# EAGLE design Reactor Core (EAGLE 6.2)

## Sheet 1 of 4
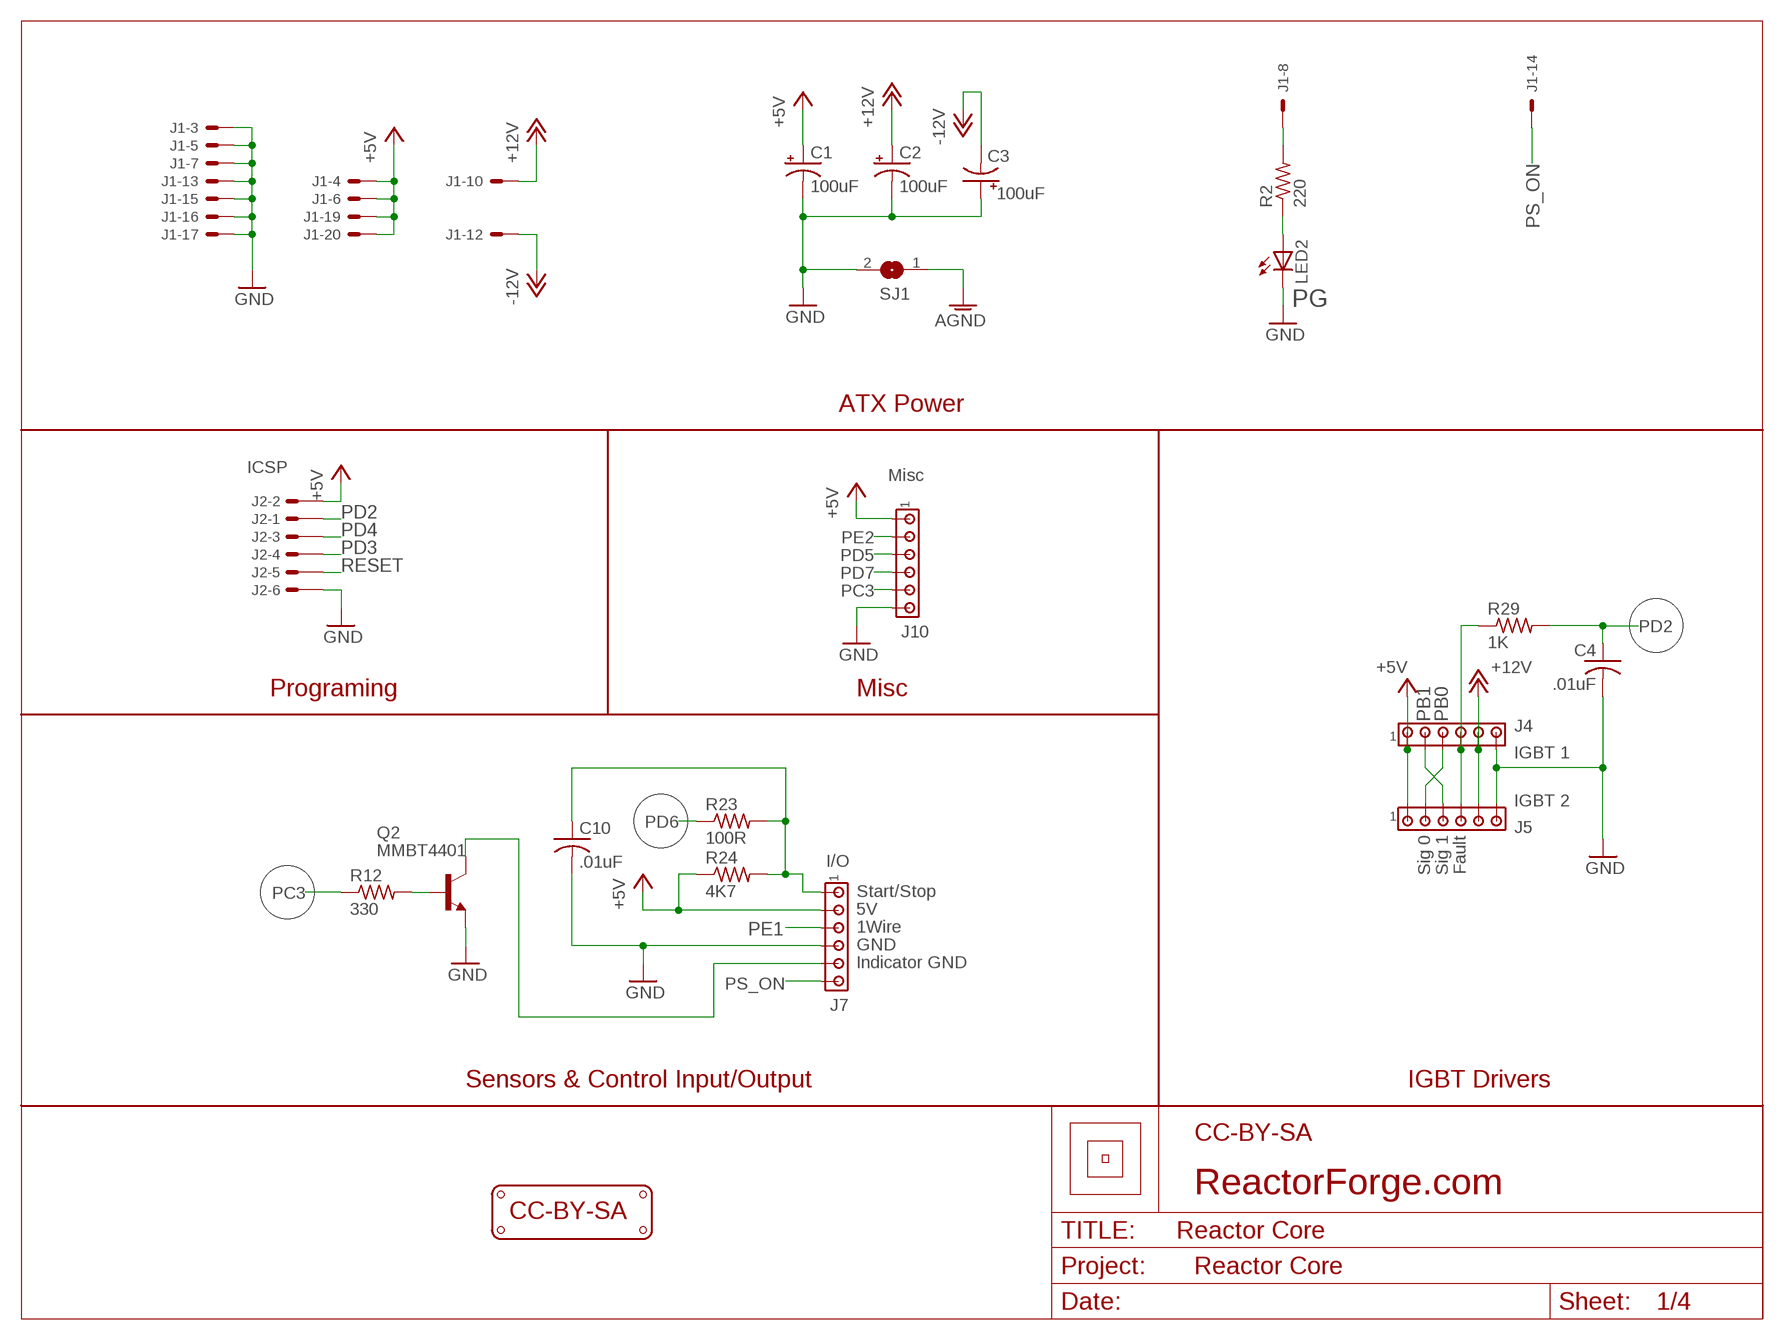
[diagram p0: schematic, sheet 1]
U$1 (LETTER_L): LICENSE: CC-BY-SA; PROJECT: Reactor Core; URL: ReactorForge.com

### Parts
C1  100uF  CPOL-USE2-5  [E2-5]
C2  100uF  CPOL-USE2-5  [E2-5]
C3  100uF  CPOL-USE2-5  [E2-5]
C4  .01uF  C-USC1206  [C1206]
C10  .01uF  C-USC1206K  [C1206K]
J1  ATX Power  5566-20  [5566-20]
J2  ICSP  057-006-1  [057-006-1]
J4  IGBT 1  MTA06-100  [10X06MTA]
J5  IGBT 2  MTA06-100  [10X06MTA]
J7  I/O  MTA06-100  [10X06MTA]
J10  Misc  MTA06-100  [10X06MTA]
LED2  LEDCHIPLED_1206  [CHIPLED_1206]
LOGO1  LOGO_CC-BY-SA  [LOGO_CC-BY-SA]
Q2  MMBT4401  [SOT23]
R2  220  R-US_R1206  [R1206]
R12  330  R-US_R1206  [R1206]
R23  100R  R-US_R1206  [R1206]
R24  4K7  R-US_R1206  [R1206]
R29  1K  R-US_R1206  [R1206]
SJ1  0  SJ  [SJ]

### Nets
+5V [power]: C1.+ J1.4 J1.6 J1.19 J1.20 J2.2 J4.6 J5.6 J7.5 J10.6 R24.1 ; also sheet 2,3
+12V [power]: C2.+ J1.10 J4.2 J5.2 ; also sheet 3
-12V [power]: C3.- J1.12 ; also sheet 3
AGND [power]: SJ1.1 ; also sheet 2
FAULT: J4.3 J5.3 R29.1
GND [power]: C1.- C2.- C3.+ C4.2 C10.2 J1.3 J1.5 J1.7 J1.13 J1.15 J1.16 J1.17 J2.6 J4.1 J5.1 J7.3 J10.1 LED2.C Q2.2(E) SJ1.2 ; also sheet 2,3
N$5: LED2.A R2.1
N$10: J7.2 Q2.3(C)
N$14: Q2.1(B) R12.2
N$17 [power]: C10.1 J7.6 R23.2 R24.2
PB0: J4.4 J5.5 ; also sheet 2
PB1: J4.5 J5.4 ; also sheet 2
PC3: J10.2 R12.1 ; also sheet 2
PD2: C4.1 J2.1 R29.2 ; also sheet 2
PD3: J2.4 ; also sheet 2
PD4: J2.3 ; also sheet 2
PD5: J10.4 ; also sheet 2,3
PD6: R23.1 ; also sheet 2
PD7: J10.3 ; also sheet 2,3
PE1: J7.4 ; also sheet 2
PE2: J10.5 ; also sheet 2
PG: J1.8 R2.2
PS_ON: J1.14 J7.1
RESET: J2.5 ; also sheet 2
Unconnected: J1.1 J1.2 J1.9 J1.11 J1.18

### Notes on the sheet
- ATX Power
- Programing | Misc
- Sig 0 | Sig 1 | Fault
- Start/Stop
- 5V
- 1Wire
- GND
- Indicator GND
- Sensors & Control Input/Output | IGBT Drivers

## Sheet 2 of 4
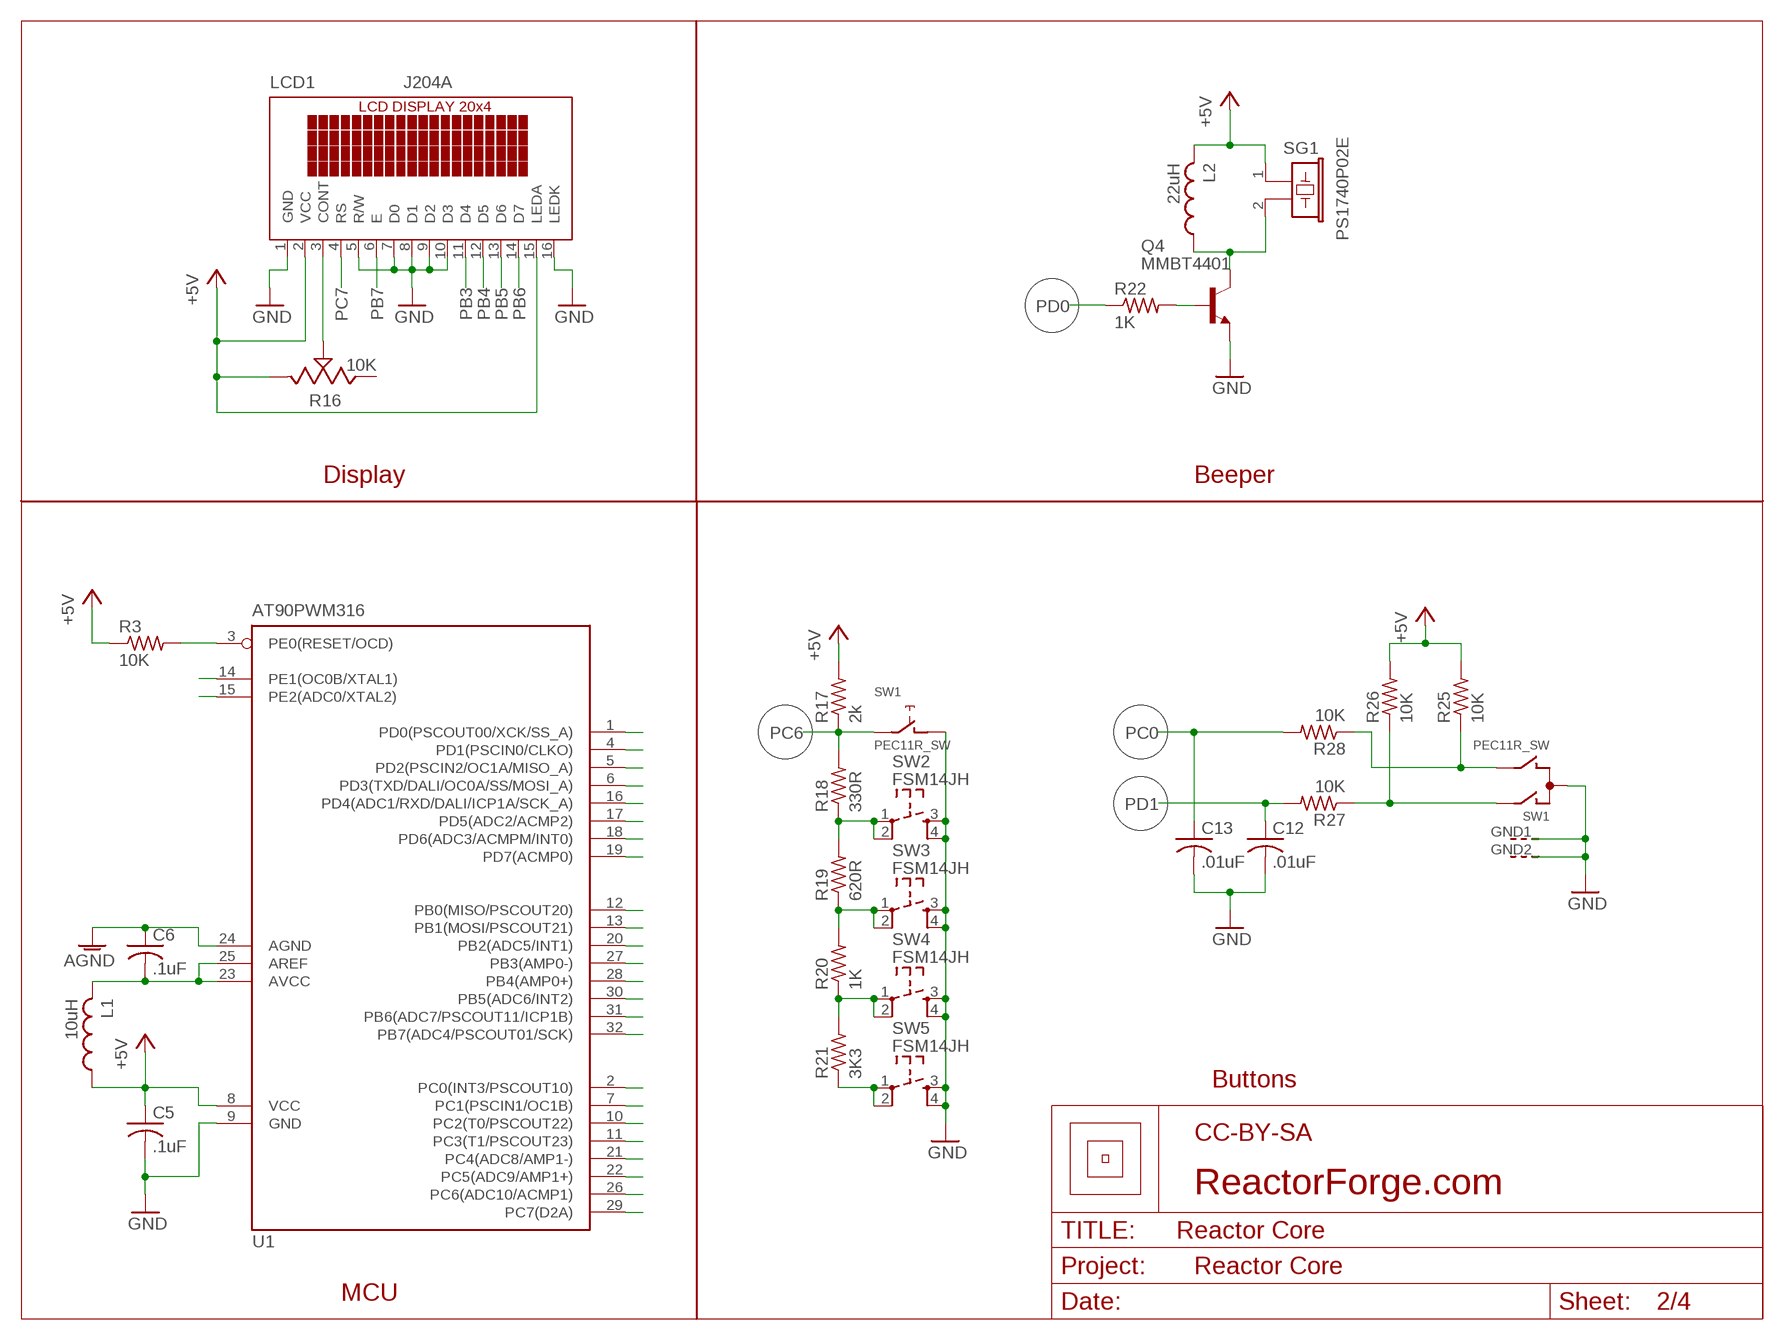
[diagram p1: schematic, sheet 2]
U$3 (LETTER_L): LICENSE: CC-BY-SA; PROJECT: Reactor Core; URL: ReactorForge.com

### Parts
C5  .1uF  C-USC1206K  [C1206K]
C6  .1uF  C-USC1206K  [C1206K]
C12  .01uF  C-USC1206K  [C1206K]
C13  .01uF  C-USC1206K  [C1206K]
L1  10uH  L-USL3225P  [L3225P]
L2  22uH  L-USL3225P  [L3225P]
LCD1  J204A  [LCD-20X4]
Q4  MMBT4401  [SOT23]
R3  10K  R-US_R1206  [R1206]
R16  10K  TRIMMER_3314G  [TRIMMER_3314G]
R17  2k  R-US_R1206  [R1206]
R18  330R  R-US_R1206  [R1206]
R19  620R  R-US_R1206  [R1206]
R20  1K  R-US_R1206  [R1206]
R21  3K3  R-US_R1206  [R1206]
R22  1K  R-US_R1206  [R1206]
R25  10K  R-US_M1206  [M1206]
R26  10K  R-US_M1206  [M1206]
R27  10K  R-US_R1206  [R1206]
R28  10K  R-US_R1206  [R1206]
SG1  PS1740P02E  F/EE17P  [F/EE17P]
SW1  PEC11R_SW  [BOURNS_PEC11R_SW]
SW2  FSM14JH  SW_TACTILE_TOP_ACTIVATED  [SW_TACTILE_TOP_ACTIVATED]
SW3  FSM14JH  SW_TACTILE_TOP_ACTIVATED  [SW_TACTILE_TOP_ACTIVATED]
SW4  FSM14JH  SW_TACTILE_TOP_ACTIVATED  [SW_TACTILE_TOP_ACTIVATED]
SW5  FSM14JH  SW_TACTILE_TOP_ACTIVATED  [SW_TACTILE_TOP_ACTIVATED]
U1  AT90PWM316  [SOIC-32]

### Nets
+5V [power]: C5.1 L1.1 L2.2 LCD1.2(VCC) LCD1.15(LEDA) R3.1 R16.3 R17.2 R25.2 R26.2 SG1.1 U1.8(VCC) ; also sheet 1,3
AGND [power]: C6.1 U1.24(AGND) ; also sheet 1
AVCC [power]: C6.2 L1.2 U1.23(AVCC) U1.25(AREF)
GND [power]: C5.2 C12.2 C13.2 LCD1.1(GND) LCD1.5(R/W) LCD1.7(D0) LCD1.8(D1) LCD1.9(D2) LCD1.10(D3) LCD1.16(LEDK) Q4.2(E) SW1.C SW1.GND1(G) SW1.GND2(G) SW1.S SW2.3 SW2.4 SW3.3 SW3.4 SW4.3 SW4.4 SW5.3 SW5.4 U1.9(GND) ; also sheet 1,3
N$3 [power]: LCD1.3(CONT) R16.2
N$19 [power]: L2.1 Q4.3(C) SG1.2
N$20 [power]: Q4.1(B) R22.2
N$21 [power]: R25.1 R28.1 SW1.B
N$22 [power]: R26.1 R27.1 SW1.A
N$23 [power]: R21.1 SW5.1 SW5.2
N$24 [power]: R18.1 R19.2 SW2.1 SW2.2
N$25 [power]: R19.1 R20.2 SW3.1 SW3.2
N$26 [power]: R20.1 R21.2 SW4.1 SW4.2
PB0: U1.12(PB0(MISO/PSCOUT20)) ; also sheet 1
PB1: U1.13(PB1(MOSI/PSCOUT21)) ; also sheet 1
PB2: U1.20(PB2(ADC5/INT1)) ; also sheet 3
PB3: LCD1.11(D4) U1.27(PB3(AMP0-))
PB4: LCD1.12(D5) U1.28(PB4(AMP0+))
PB5: LCD1.13(D6) U1.30(PB5(ADC6/INT2))
PB6: LCD1.14(D7) U1.31(PB6(ADC7/PSCOUT11/ICP1B))
PB7: LCD1.6(E) U1.32(PB7(ADC4/PSCOUT01/SCK))
PC0: C13.1 R28.2 U1.2(PC0(INT3/PSCOUT10))
PC1: U1.7(PC1(PSCIN1/OC1B)) ; also sheet 3
PC2: U1.10(PC2(T0/PSCOUT22)) ; also sheet 3
PC3: U1.11(PC3(T1/PSCOUT23)) ; also sheet 1
PC4: U1.21(PC4(ADC8/AMP1-)) ; also sheet 3
PC5: U1.22(PC5(ADC9/AMP1+)) ; also sheet 3
PC6: R17.1 R18.2 SW1.W U1.26(PC6(ADC10/ACMP1))
PC7: LCD1.4(RS) U1.29(PC7(D2A))
PD0: R22.1 U1.1(PD0(PSCOUT00/XCK/SS_A))
PD1: C12.1 R27.2 U1.4(PD1(PSCIN0/CLKO))
PD2: U1.5(PD2(PSCIN2/OC1A/MISO_A)) ; also sheet 1
PD3: U1.6(PD3(TXD/DALI/OC0A/SS/MOSI_A)) ; also sheet 1
PD4: U1.16(PD4(ADC1/RXD/DALI/ICP1A/SCK_A)) ; also sheet 1
PD5: U1.17(PD5(ADC2/ACMP2)) ; also sheet 1,3
PD6: U1.18(PD6(ADC3/ACMPM/INT0)) ; also sheet 1
PD7: U1.19(PD7(ACMP0)) ; also sheet 1,3
PE1: U1.14(PE1(OC0B/XTAL1)) ; also sheet 1
PE2: U1.15(PE2(ADC0/XTAL2)) ; also sheet 1
RESET: R3.2 U1.3(PE0(RESET/OCD)) ; also sheet 1
Unconnected: R16.1

### Notes on the sheet
- Display | Beeper
- Buttons
- MCU

## Sheet 3 of 4
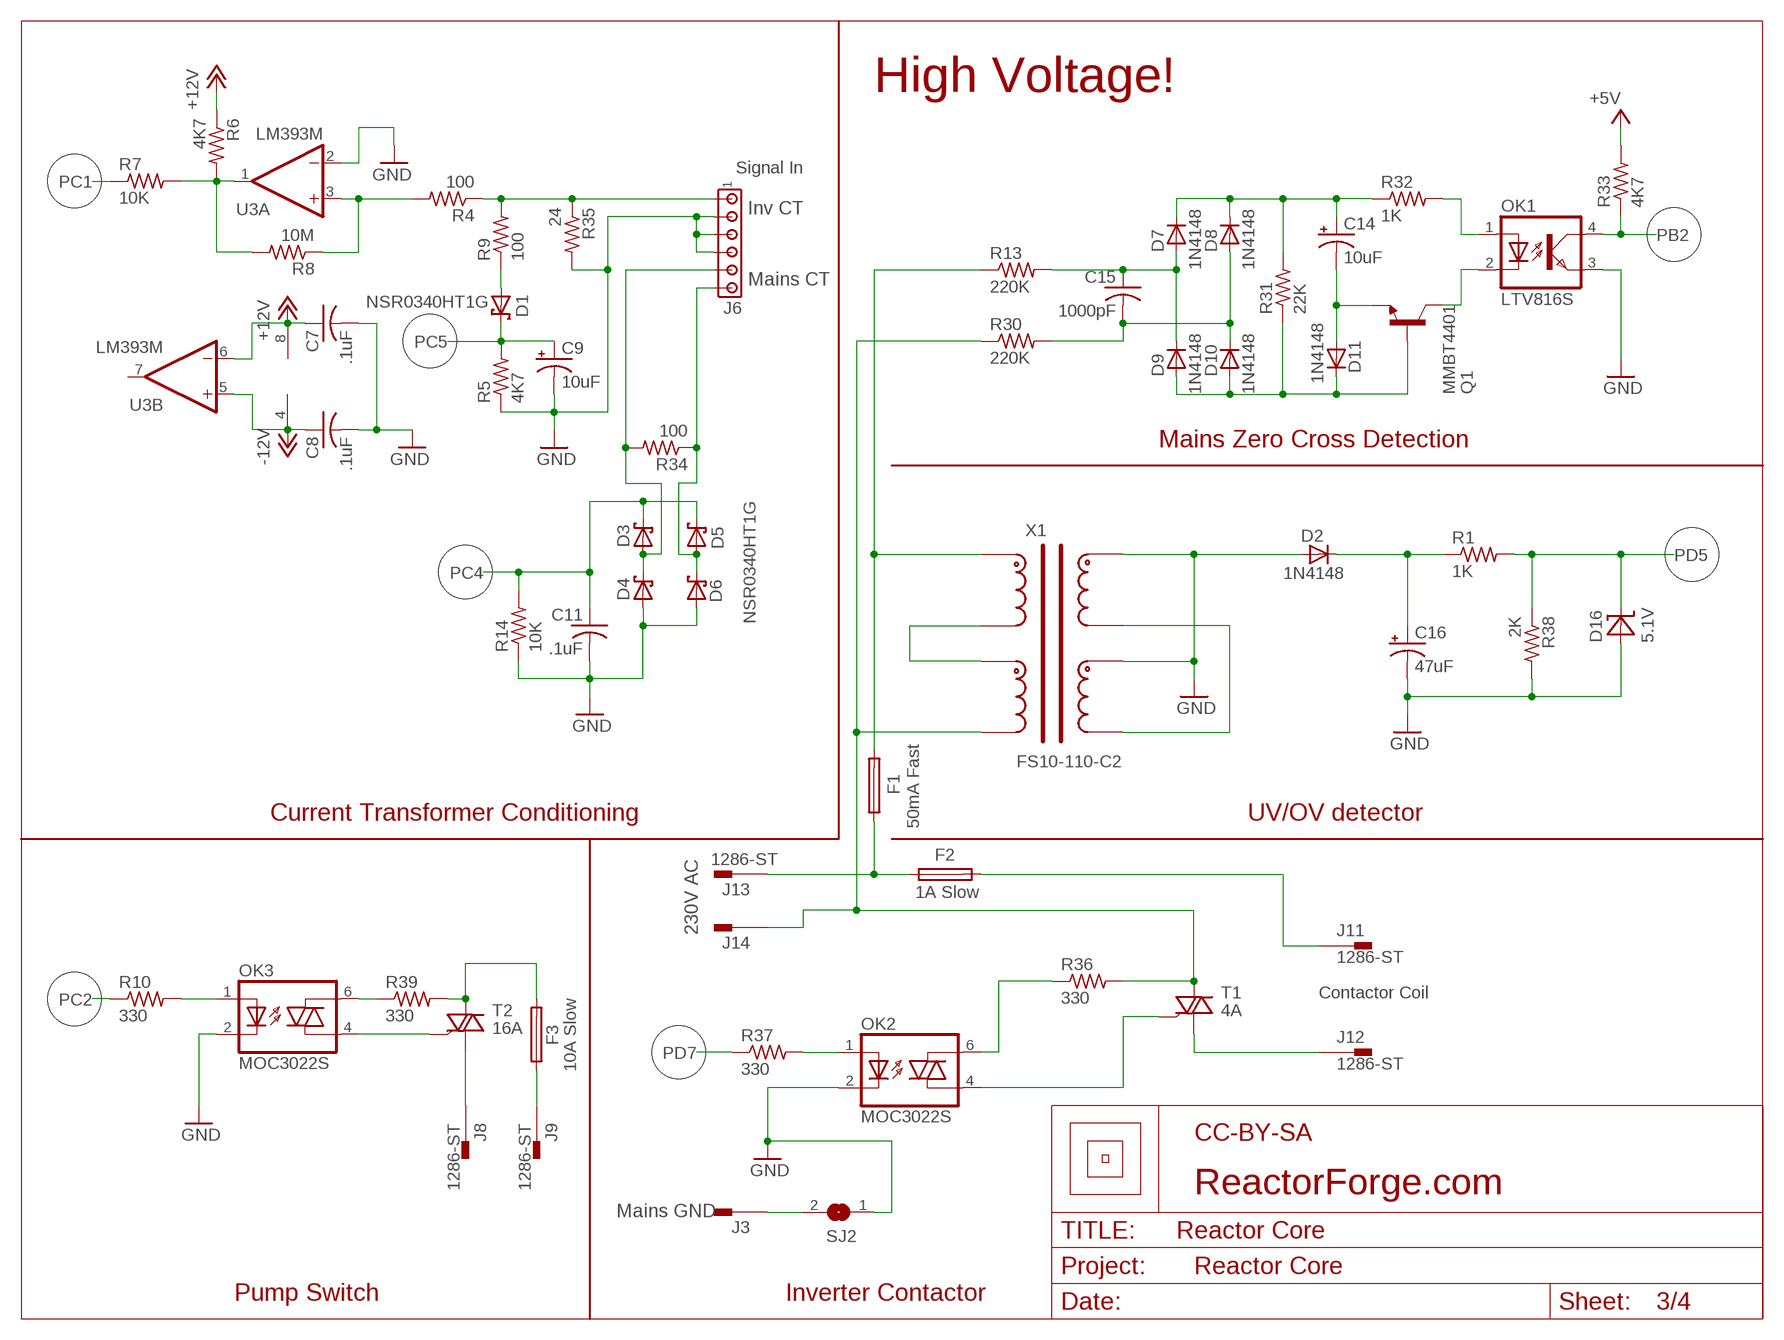
[diagram p2: schematic, sheet 3]
U$4 (LETTER_L): LICENSE: CC-BY-SA; PROJECT: Reactor Core; URL: ReactorForge.com

### Parts
C7  .1uF  C-USC1206  [C1206]
C8  .1uF  C-USC1206  [C1206]
C9  10uF  CPOL-US153CLV-0405  [153CLV-0405]
C11  .1uF  C-USC1206  [C1206]
C14  10uF  CPOL-US153CLV-0405  [153CLV-0405]
C15  1000pF  C-USC1206  [C1206]
C16  47uF  CPOL-US153CLV-0605  [153CLV-0605]
D1  NSR0340HT1G  [SOD-323]
D2  1N4148  [SOD-123]
D3  NSR0340HT1G  [SOD-323]
D4  NSR0340HT1G  [SOD-323]
D5  NSR0340HT1G  [SOD-323]
D6  NSR0340HT1G  [SOD-323]
D7  1N4148  [SOD-123]
D8  1N4148  [SOD-123]
D9  1N4148  [SOD-123]
D10  1N4148  [SOD-123]
D11  1N4148  [SOD-123]
D16  5.1V  MM3Z5V1ST1G  [SOD-323]
F1  50mA Fast  TR5  [TR5]
F2  1A Slow  FC211-5X20  [FC211-5X20]
F3  10A Slow  FC211-5X20  [FC211-5X20]
J3  1286-ST  PIN262409-1  [62409-1]
J6  Signal In  MTA06-100  [10X06MTA]
J8  1286-ST  PIN262409-1  [62409-1]
J9  1286-ST  PIN262409-1  [62409-1]
J11  1286-ST  PIN262409-1  [62409-1]
J12  1286-ST  PIN262409-1  [62409-1]
J13  1286-ST  PIN262409-1  [62409-1]
J14  1286-ST  PIN262409-1  [62409-1]
OK1  LTV816S  [SMD4]
OK2  MOC3022S  [6-SMD]
OK3  MOC3022S  [6-SMD]
Q1  MMBT4401  [SOT23]
R1  1K  R-US_R1206  [R1206]
R4  100  R-US_R1206  [R1206]
R5  4K7  R-US_R1206  [R1206]
R6  4K7  R-US_R1206  [R1206]
R7  10K  R-US_R1206  [R1206]
R8  10M  R-US_R1206  [R1206]
R9  100  R-US_R1206  [R1206]
R10  330  R-US_M1206  [M1206]
R13  220K  R-US_R1206  [R1206]
R14  10K  R-US_R1206  [R1206]
R30  220K  R-US_R1206  [R1206]
R31  22K  R-US_R1206  [R1206]
R32  1K  R-US_R1206  [R1206]
R33  4K7  R-US_R1206  [R1206]
R34  100  R-US_R1206  [R1206]
R35  24  R-US_R2512  [R2512]
R36  330  R-US_R1206  [R1206]
R37  330  R-US_R1206  [R1206]
R38  2K  R-US_R1206  [R1206]
R39  330  R-US_R1206  [R1206]
SJ2  0  SJ  [SJ]
T1  4A  T435-600B-TR  [DPAK-TRIAC]
T2  16A  T435-600B-TR  [DPAK-TRIAC]
U3  LM393M  LM393D  [SO08]
X1  FS10-110-C2  [FS10-110-C2]

### Nets
240A: F1.1 F2.1A F2.1B J13.A1 J13.A2
240B: J14.A1 J14.A2 R30.1 R36.2 T1.A2 X1.P$4
+5V [power]: R33.2 ; also sheet 1,2
+12V [power]: C7.1 R6.1 U3.6(B:-IN) U3.8(P:V+) ; also sheet 1
-12V [power]: C8.1 U3.4(P:V-) U3.5(B:+IN) ; also sheet 1
GND [power]: C7.2 C8.2 C9.- C11.2 C16.- D2.A D4.A D6.A D16.A J6.3 J6.4 J6.5 OK1.3(EMIT) OK2.2(C) OK3.2(C) R5.1 R14.1 R35.2 R38.2 SJ2.1 U3.2(A:-IN) X1.P$5 X1.P$7 ; also sheet 1,2
MGND: J3.A1 J3.A2 SJ2.2
N$1: OK3.1(A) R10.2
N$2: OK3.6(A2) R39.1
N$4: OK2.1(A) R37.2
N$6: J6.6 R4.1 R9.2 R35.1
N$7: F3.2A F3.2B R39.2 T2.A2
N$9: R4.2 R8.1 U3.3(A:+IN)
N$11: OK3.4(A1) T2.G
N$12: R6.2 R7.2 R8.2 U3.1(A:OUT)
N$13: D1.A R9.1
N$15: D3.A D4.C J6.2 R34.2
N$16 [power]: D5.A D6.C J6.1 R34.1
N$18: X1.P$6 X1.P$8
N$28: X1.P$2 X1.P$3
N$29: C15.1 D7.A D9.C R13.2
N$30: C15.2 D8.A D10.C R30.2
N$31: OK2.6(A2) R36.1
N$32: OK2.4(A1) T1.G
N$33: D9.A D10.A D11.C Q1.1(B) R31.1
N$34: C14.+ D7.C D8.C R31.2 R32.1
N$35: C14.- D11.A Q1.2(E)
N$37: J12.A1 J12.A2 T1.A1
N$38: OK1.1(A) R32.2
N$39: OK1.2(C) Q1.3(C)
N$40: F2.2A F2.2B J11.A1 J11.A2
N$43: J8.A1 J8.A2 T2.A1
N$44: C16.+ D2.C R1.1
N$45: F1.2 R13.1 X1.P$1
N$46: F3.1A F3.1B J9.A1 J9.A2
PB2: OK1.4(COL) R33.1 ; also sheet 2
PC1: R7.1 ; also sheet 2
PC2: R10.1 ; also sheet 2
PC4: C11.1 D3.C D5.C R14.2 ; also sheet 2
PC5: C9.+ D1.C R5.2 ; also sheet 2
PD5: D16.C R1.2 R38.1 ; also sheet 1,2
PD7: R37.1 ; also sheet 1,2
Unconnected: U3.7(B:OUT)

### Notes on the sheet
- High Voltage!
- Inv CT
- Mains CT
- Mains Zero Cross Detection
- Current Transformer Conditioning | UV/OV detector
- 230V AC
- Contactor Coil
- Mains GND
- Pump Switch | Inverter Contactor

## Sheet 4 of 4
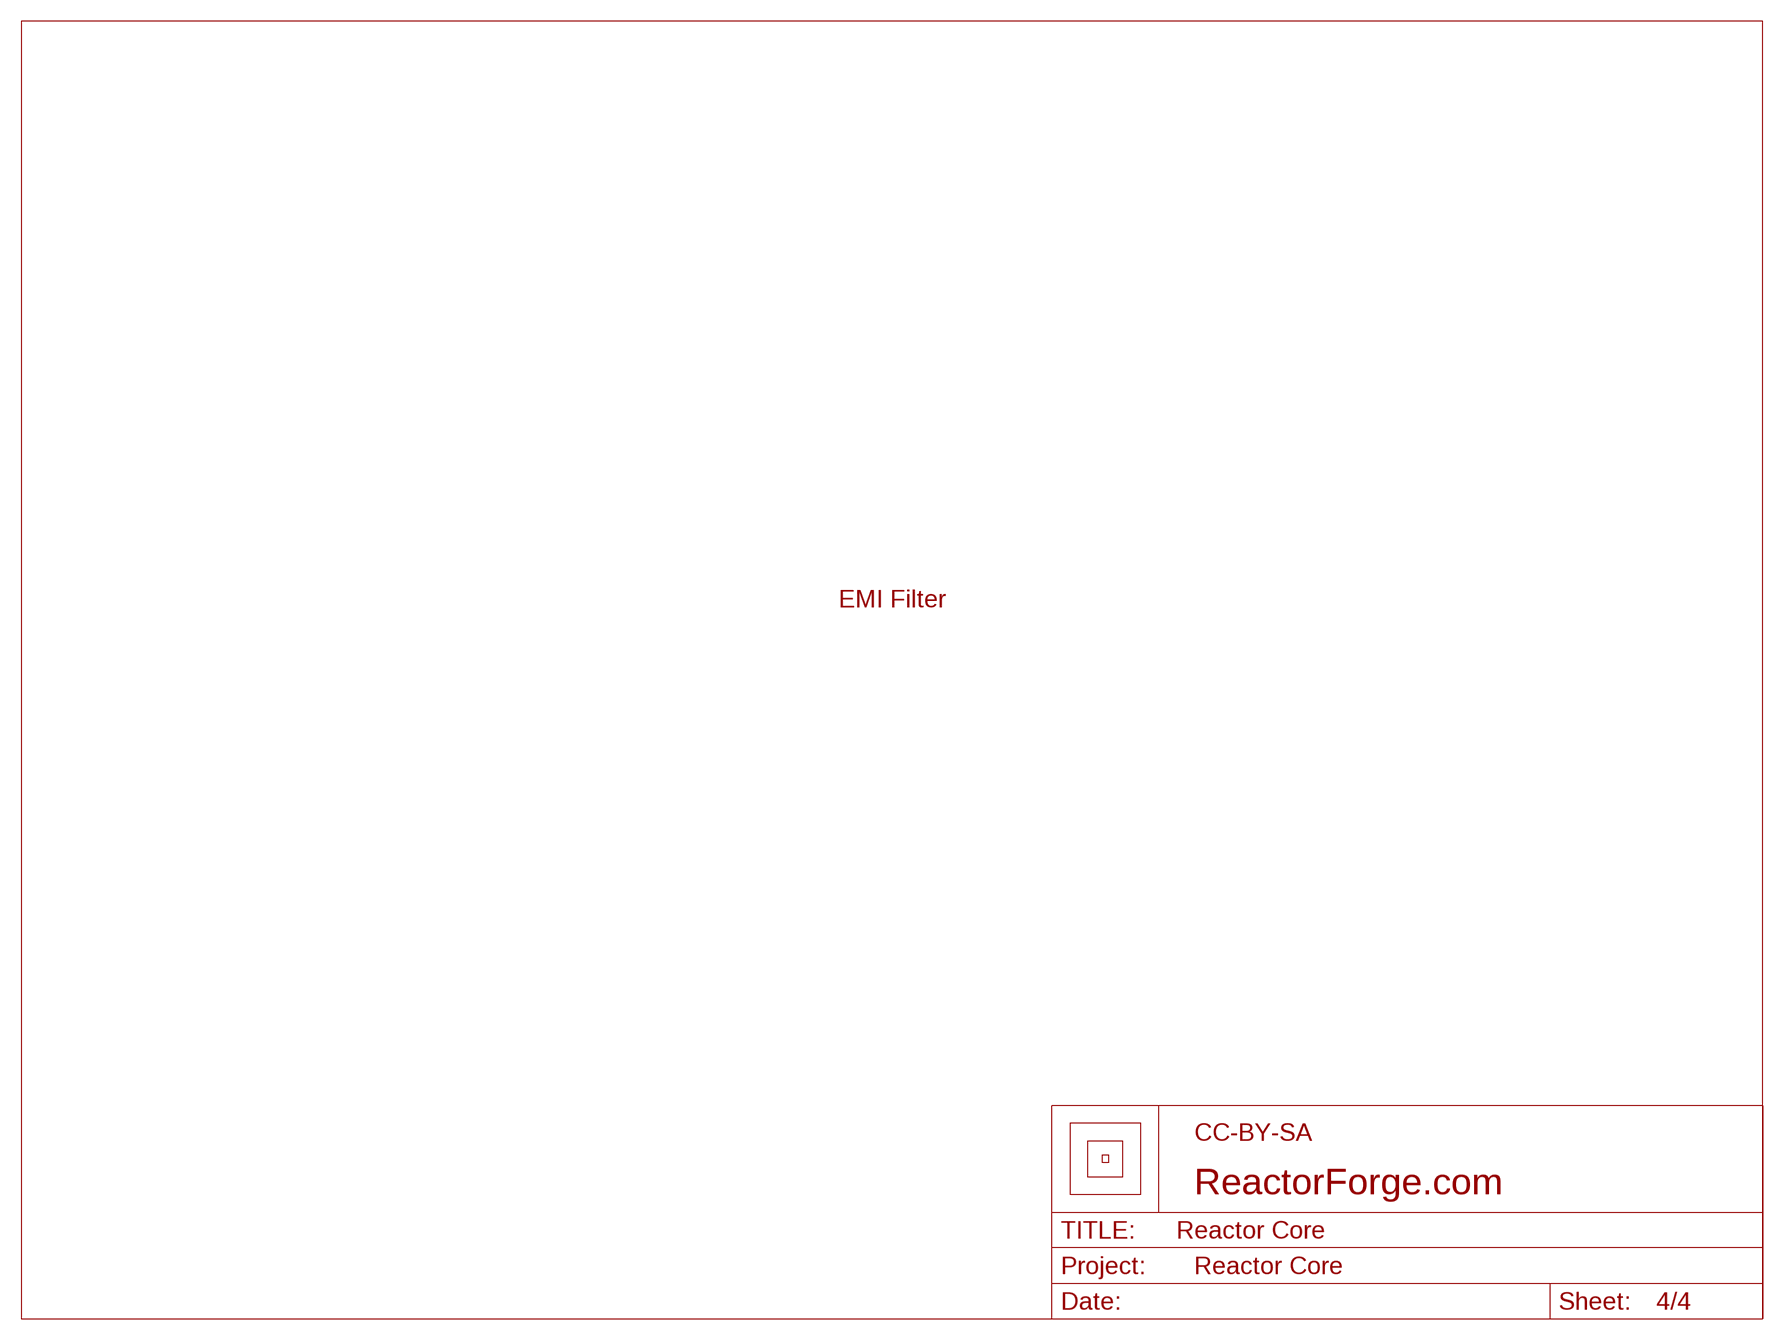
[diagram p3: schematic, sheet 4]
U$5 (LETTER_L): LICENSE: CC-BY-SA; PROJECT: Reactor Core; URL: ReactorForge.com

### Notes on the sheet
- EMI Filter

## Library data of the parts
C1-C3 C9 C14 C16 = resistor:CPOL-US: POLARIZED CAPACITOR, American symbol
C4-C8 C10-C13 C15 = resistor:C-US: CAPACITOR, American symbol
D1 D3-D6 = 1-Custom:NSR0340HT1G: NSR0340HT1G Schottky Barrier Diode Vf = 415mV trr = 5nS
D2 D7-D11 = 1-Custom:1N4148: 1N4148
D16 = 1-Custom:MM3Z5V1ST1G: MM3Z5V1ST1G Zener 5.1V 200MW; MF: 5.1V 200MW; MPN: MM3Z5V1ST1G; PN_DIGI-KEY: MM3Z5V1ST1GOSCT-ND
F1 = fuse:TR5: FUSE Wickmann; MF: Bel Fuse Inc; MPN: MRF 50; OC_FARNELL: unknown; OC_NEWARK: unknown; PN_DIGI-KEY: 507-1715-ND
F2 F3 = 1-Custom:FC211-5X20: FC 211 5mm x 20mm Fuse Clip Cartridge 10A
J1 = con-molex:5566-20: Mini FIT connector 20 pol ATX PC-Motherboard Power connector Source: http://www.molex.com; MPN: 39-29-9206; OC_FARNELL: unknown; OC_NEWARK: unknown; PN_DIGI-KEY: 2M3873-ND
J2 = con-panduit:057-006-: CONNECTOR 6-pin series 057 contact pc board low profile headers; OC_FARNELL: unknown; OC_NEWARK: unknown
J3 J8 J9 J11-J14 = con-faston:PIN2: Flachstecker Typ Tyco/Electronics/AMP TAB, FASTON Printed Circuit Board Tabs Source: http://www.buerklin.com, http://catalog.tycoelectronics.com; OC_FARNELL: unknown; OC_NEWARK: unknown
J4-J7 J10 = con-amp:MTA06-100: AMP connector
L1 L2 = resistor:L-US: INDUCTOR, American symbol
LCD1 = 1-Custom:J204A: J204A 20x4 character LCD Samsung KS0066 Controller (Hitachi HD44780 Clone)
LED2 = led:LED: LED OSRAM: - CHIPLED LG R971, LG N971, LY N971, LG Q971, LY Q971, LO R971, LY R971 LH N974, LH R974 LS Q976, LO Q976, LY Q976 LO Q996 - Hyper CHIPLED LW Q18S LB Q993, LB Q99A, LB R99A - SideLED LS A670, LO A670, LY A670, LG A670, LP A670 LB A673, LV A673, LT A673, LW A673 LH A674 LY A675 LS A676, LA A676, LO A676, LY A676, LW A676 LS A679, LY A679, LG A679 - Hyper Micro SIDELED® LS Y876, LA Y876, LO Y876, LY Y876 LT Y87S - SmartLED LW L88C, LW L88S LB L89C, LB L89S, LG L890 LS L89K, LO L89K, LY L89K LS L896, LA L896, LO L896, LY L896 - TOPLED LS T670, LO T670, LY T670, LG T670, LP T670 LSG T670, LSP T670, LSY T670, LOP T670, LYG T670 LG T671, LOG T671, LSG T671 LB T673, LV T673, LT T673, LW T673 LH T674 LS T676, LA T676, LO T676, LY T676, LB T676, LH T676, LSB T676, LW T676 LB T67C, LV T67C, LT T67C, LS T67K, LO T67K, LY T67K, LW E67C LS E67B, LA E67B, LO E67B, LY E67B, LB E67C, LV E67C, LT E67C LW T67C LS T679, LY T679, LG T679 LS T770, LO T770, LY T770, LG T770, LP T770 LB T773, LV T773, LT T773, LW T773 LH T774 LS E675, LA E675, LY E675, LS T675 LS T776, LA T776, LO T776, LY T776, LB T776 LHGB T686 LT T68C, LB T68C - Hyper Mini TOPLED® LB M676 - Mini TOPLED Santana® LG M470 LS M47K, LO M47K, LY M47K Source: http://www.osram.convergy.de LUXEON: - LUMILED® LXK2-PW12-R00, LXK2-PW12-S00, LXK2-PW14-U00, LXK2-PW14-V00 LXK2-PM12-R00, LXK2-PM12-S00, LXK2-PM14-U00 LXK2-PE12-Q00, LXK2-PE12-R00, LXK2-PE12-S00, LXK2-PE14-T00, LXK2-PE14-U00 LXK2-PB12-K00, LXK2-PB12-L00, LXK2-PB12-M00, LXK2-PB14-N00, LXK2-PB14-P00, LXK2-PB14-Q00 LXK2-PR12-L00, LXK2-PR12-M00, LXK2-PR14-Q00, LXK2-PR14-R00 LXK2-PD12-Q00, LXK2-PD12-R00, LXK2-PD12-S00 LXK2-PH12-R00, LXK2-PH12-S00 LXK2-PL12-P00, LXK2-PL12-Q00, LXK2-PL12-R00 Source: www.luxeon.com KINGBRIGHT: KA-3528ASYC Source: www.kingbright.com
LOGO1 = dp_devices:LOGO_CC-BY-SA
OK1 = optocoupler:LTV816: OPTO COUPLER Source: LITEON, LTV816.pdf; OC_FARNELL: unknown; OC_NEWARK: unknown
OK2 OK3 = 1-Custom:MOC3022S: MOC3022S Optocoupler TRIAC output 400V; MF: Lite-On Inc; MPN: MOC3022S; PN_DIGI-KEY: 160-1377-5-ND
Q1 Q2 Q4 = 1-Custom:MMBT4401: MMBT4401 40V NPN Small Signal Transistor
R1 R34 R38 = resistor:R-US_: RESISTOR, American symbol; MF: Stackpole Electronics Inc; MPN: RNCP1206FTD100R; PN_DIGI-KEY: RNCP1206FTD100RCT-ND
R2-R10 R12-R14 R17-R33 R36 R37 R39 = resistor:R-US_: RESISTOR, American symbol
R16 = 1-Custom:TRIMMER_3314G: 3314G Trimmer Pot
R35 = resistor:R-US_: RESISTOR, American symbol; MF: TE Connectivity; MPN: 352124RFT; PN_DIGI-KEY: A115993CT-ND
SG1 = buzzer:F/EE17P: BUZZER Source: Buerklin; MPN: PS1740P02E; OC_FARNELL: unknown; OC_NEWARK: unknown; PN_DIGI-KEY: 445-2528-ND
SJ1 SJ2 = jumper:SJ: SMD solder JUMPER
SW1 = rotary-encoders:PEC11R_SW: Bourns Rotary Encoder PEC11R series with switch http://www.bourns.com/data/global/pdfs/PEC11R.pdf; MF: Bourns; MPN: PEC11R-4215K-S0012; PN_DIGI-KEY: PEC11R-4215K-S0012-ND
SW2-SW5 = 1-Custom:SW_TACTILE_TOP_ACTIVATED
T1 = 1-Custom:T435-600B-TR: T435-600B-TR TRIAC ALTERNISTOR 600V 4A DPAK; MF: STMicroelectronics; MPN: T435-600B-TR; PN_DIGI-KEY: 497-2513-1-ND
T2 = 1-Custom:T435-600B-TR: T435-600B-TR TRIAC ALTERNISTOR 600V 4A DPAK; MF: STMicroelectronics; MPN: T1635-700G-TR; PN_DIGI-KEY: 497-4433-1-ND
U1 = 1-Custom:AT90PWM316
U3 = linear:LM393: COMPARATOR; MF: Fairchild Semiconductor; MPN: LM393M; PN_DIGI-KEY: LM393MFS-ND
X1 = 1-Custom:FS10-110-C2: FS10-110-C2 Primary: 115V, 230V Secondary: Parallel 5V, Series 10V Current: Parallel 220mA, Series 110mA (1.1VA Max); MF: Triad Magnetics; MPN: FS10-110-C2-B; PN_DIGI-KEY: 237-1578-ND

## Net classes
0 default: width 0.254 mm
1 power: width 0.635 mm

## Board
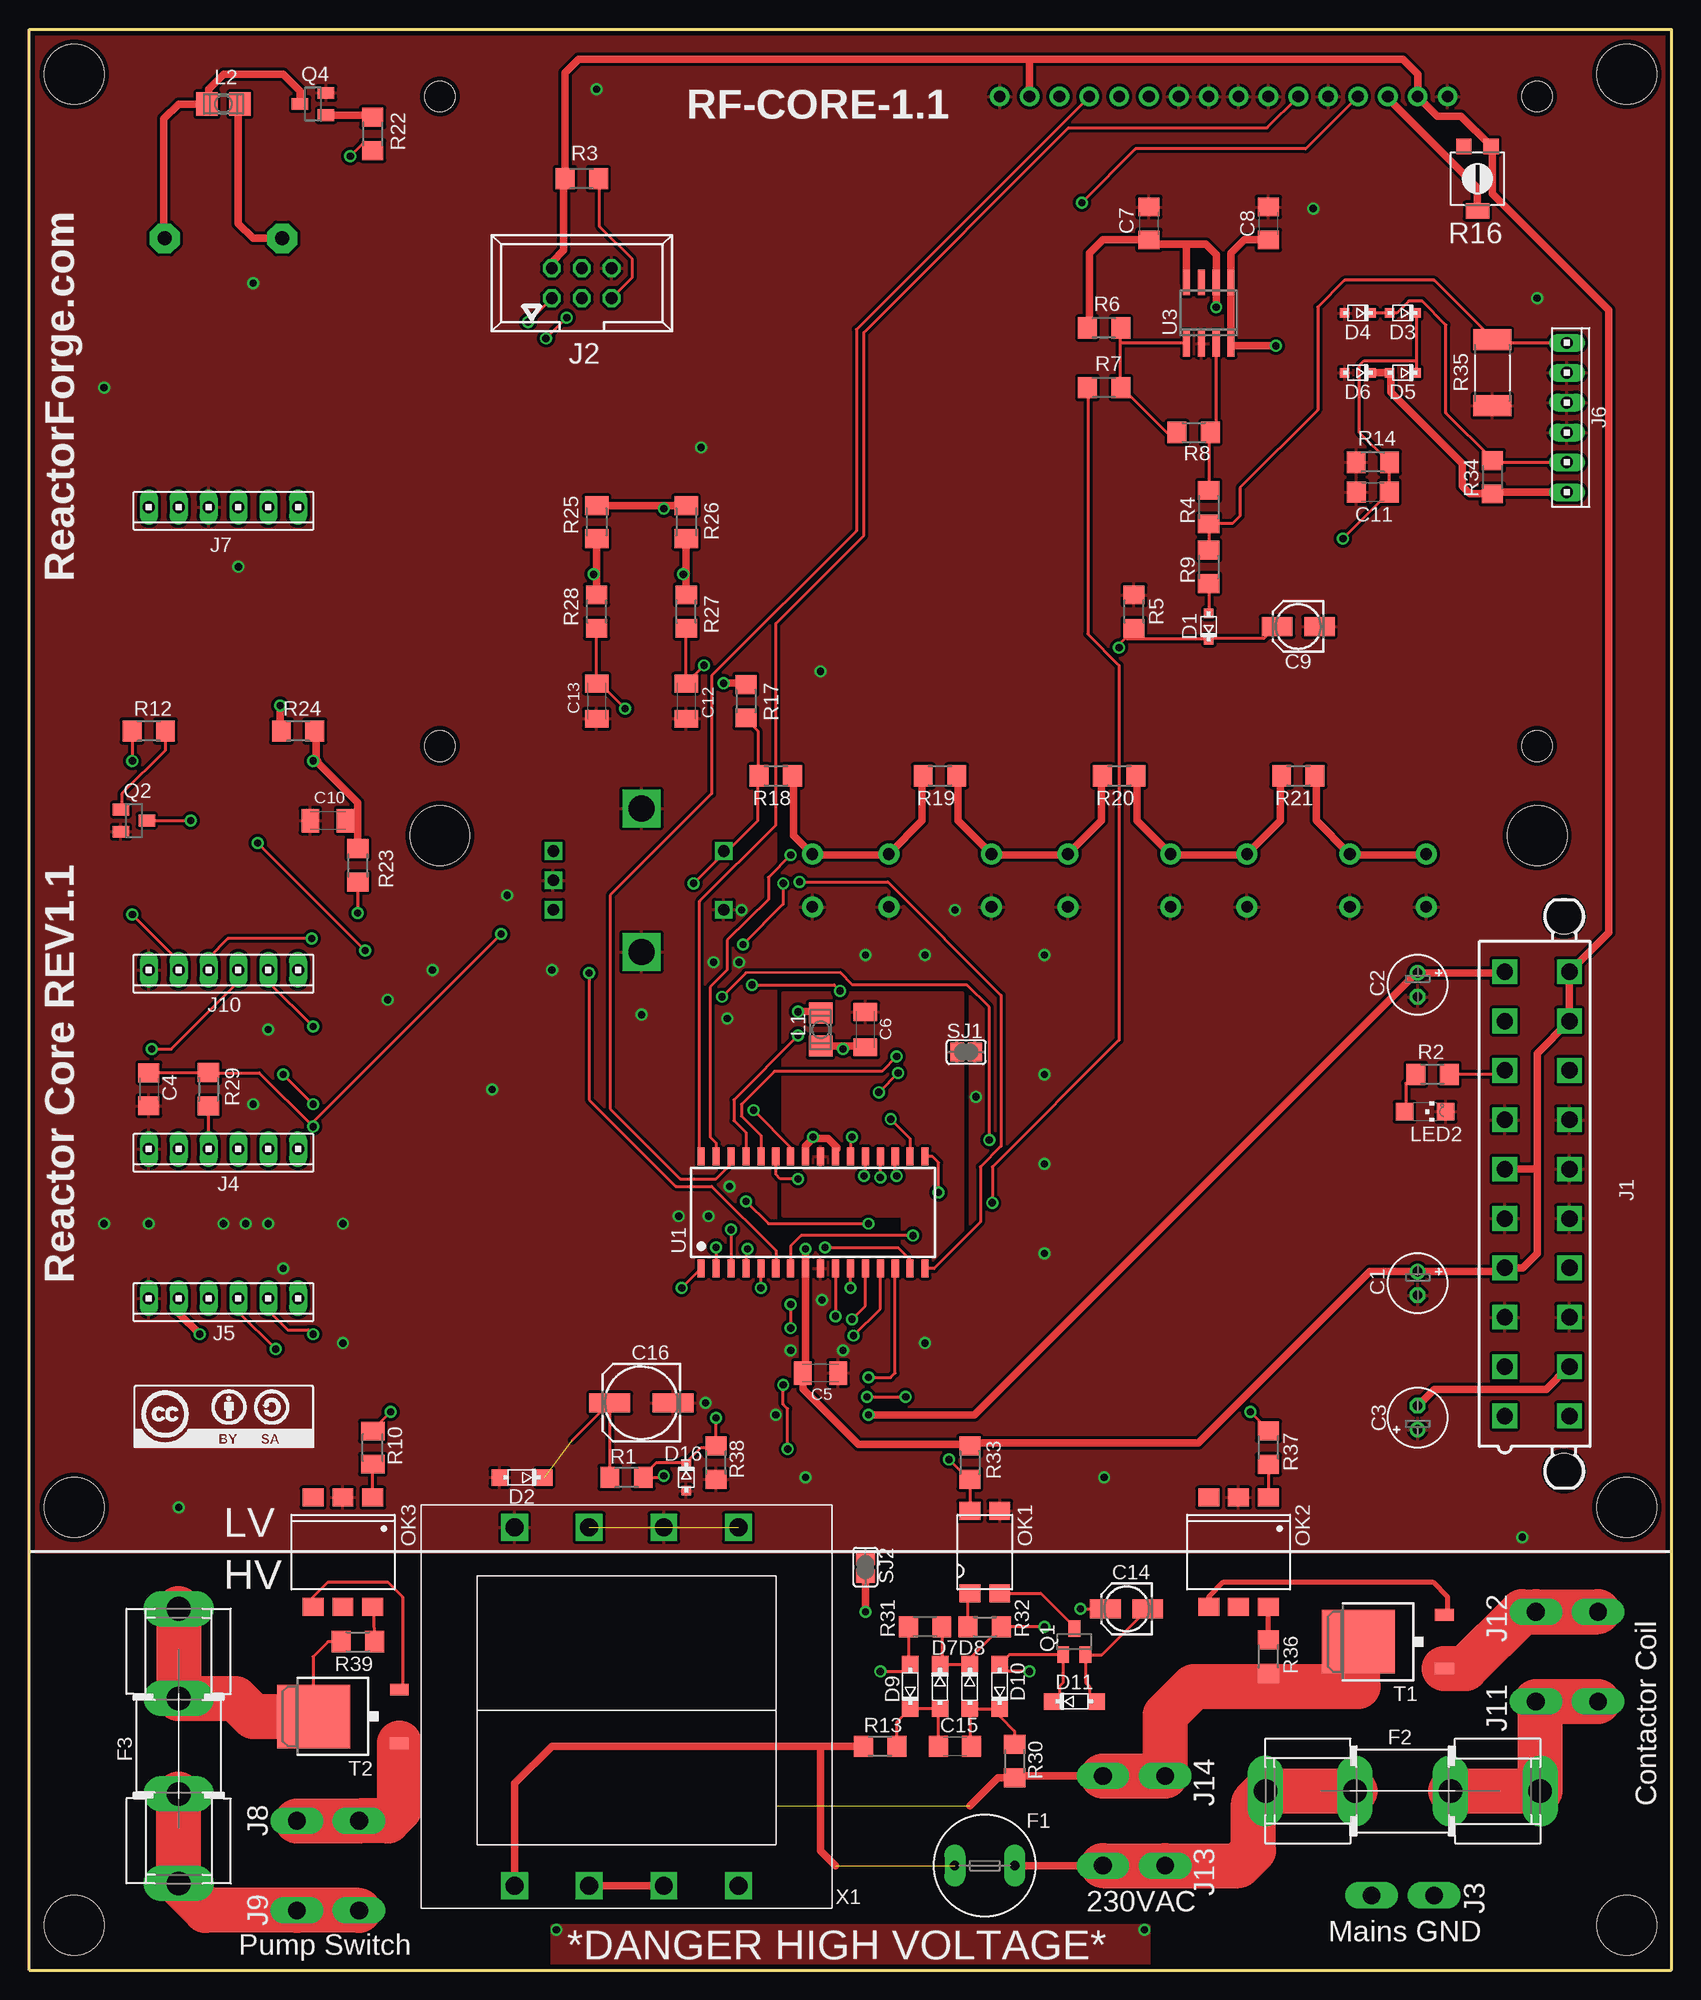
[diagram p4: board, top side]
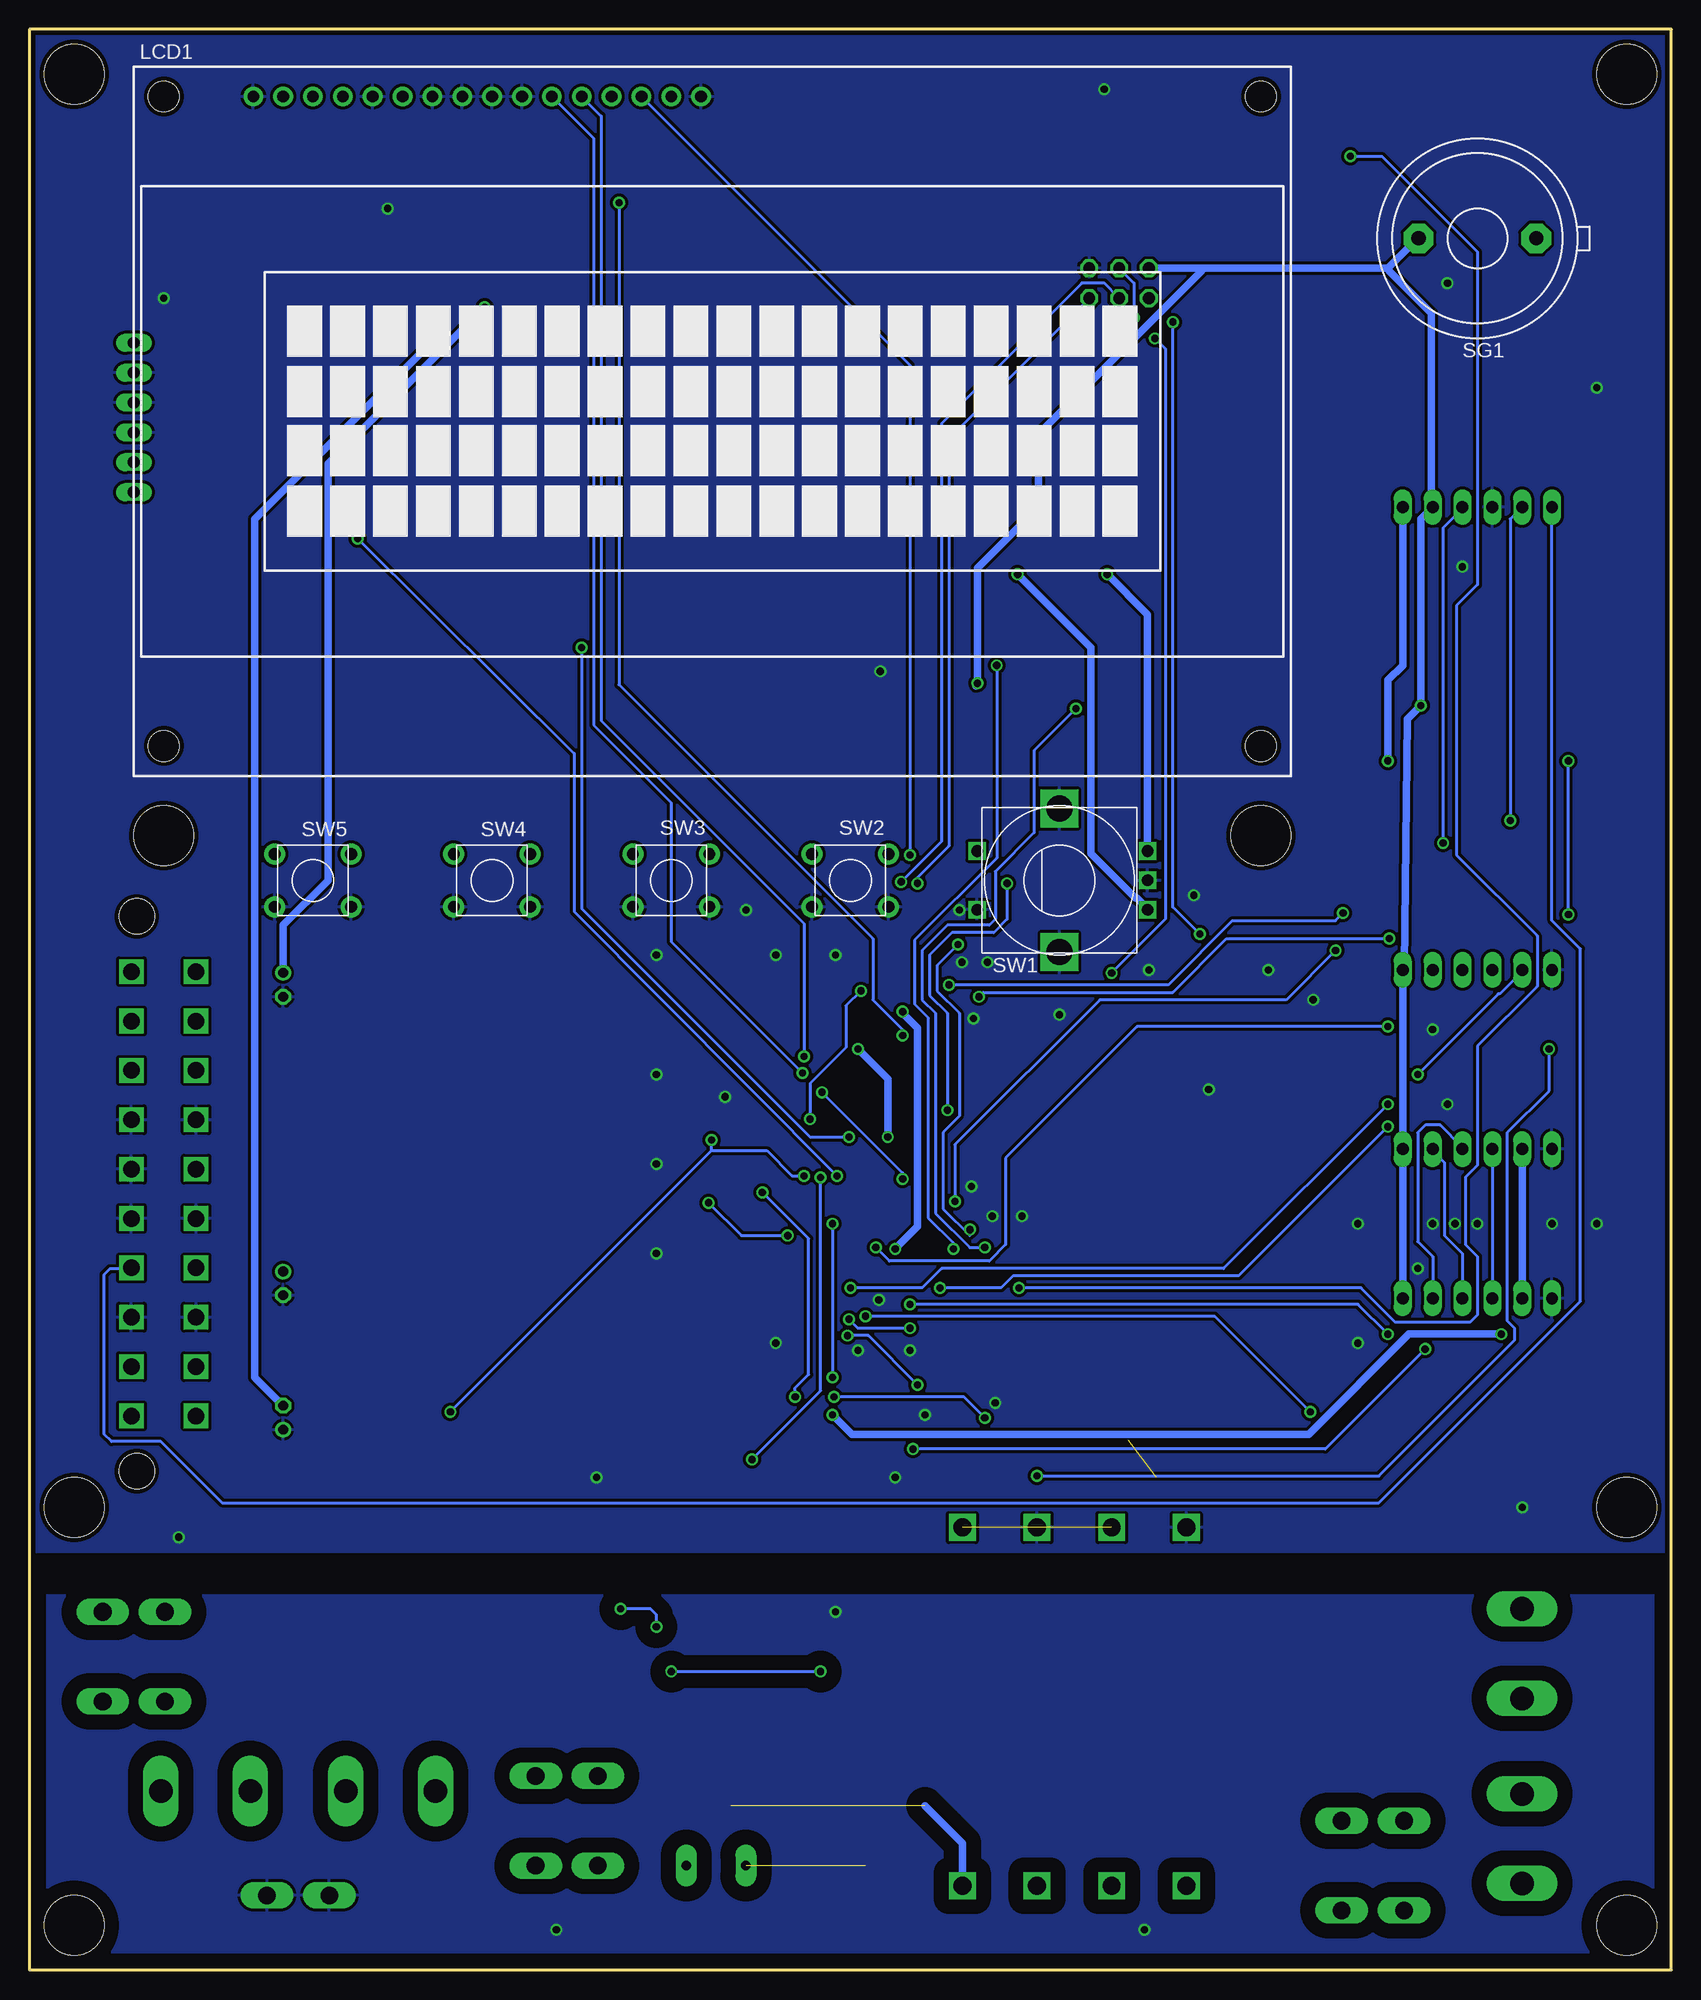
[diagram p5: board, bottom side, seen from below]

Size 139.7 x 165.1 mm. Coordinates in mm from the lower left corner, seen from the top.
Outline: 0,165.1 139.7,165.1 139.7,0 0,0 0,165.1
Copper layers (1*16): Top 0.035mm / dielectric 1.5mm / Bottom 0.035mm
Design rules: minimum track width 10mil, minimum drill 24mil, track to track 10mil, track to pad 10mil, pad to pad 10mil, via to via 10mil, smd to smd 10mil, copper to edge 15mil, drill to drill 15mil, minimum pad ring 10mil, minimum via ring 8mil, stop-mask expansion 5mil, vias tented up to drill 0mil, thermal gap 10mil
Holes 5.08 mm at 3.81,3.81 135.89,3.81 3.81,161.29 135.89,161.29 135.89,39.37 3.81,39.37 34.92,96.52 128.27,96.52
tRestrict: area 0,33.4 to 69.8,35.3; area 72.4,33.4 to 139.7,35.3
bRestrict: area 0,33.4 to 139.7,35.3

### Footprints (pad centres in the part's own frame; a part is rotated, then mirrored left to right if it is on the bottom)
E2-5 = drill 0.813 pad 1.27: + -1.016,0 | drill 0.813 pad 1.27 octagon: - 1.016,0
C1206 = smd 1.6 x 1.8: 1 -1.4,0; 2 1.4,0
C1206K = smd 1.5 x 2: 1 -1.5,0; 2 1.5,0
153CLV-0405 = smd 2.6 x 1.6: + 1.8,0; - -1.8,0
153CLV-0605 = smd 3.5 x 1.6: + 2.7,0; - -2.7,0
SOD-323 = smd 0.8 x 0.8: A 1.125,0; C -1.125,0
SOD-123 = smd 1.4 x 1.4: A 3.17,0; C -0.63,0
TR5 = drill 0.813 pad 1.778 long: 1 -2.54,0; 2 2.54,0
FC211-5X20 = drill 2.007 long: 1A -11.684,0; 1B -4.064,0; 2A 4.064,0; 2B 11.684,0
5566-20 = drill 1.4 square: 1 18.9,-2.75; 2 14.7,-2.75; 3 10.5,-2.75; 4 6.3,-2.75; 5 2.1,-2.75; 6 -2.1,-2.75; 7 -6.3,-2.75; 8 -10.5,-2.75; 9 -14.7,-2.75; 10 -18.9,-2.75; 11 18.9,2.75; 12 14.7,2.75; 13 10.5,2.75; 14 6.3,2.75; 15 2.1,2.75; 16 -2.1,2.75; 17 -6.3,2.75; 18 -10.5,2.75; 19 -14.7,2.75; 20 -18.9,2.75 | hole 3: 23.6,2.29; -23.6,2.29
057-006-1 = drill 1 octagon: 1 -2.54,-1.27; 2 -2.54,1.27; 3 0,-1.27; 4 0,1.27; 5 2.54,-1.27; 6 2.54,1.27
62409-1 = drill 1.5 pad 1.9 long: A1 -2.65,0; A2 2.65,0
10X06MTA = drill 1.016 long: 1 6.35,0; 2 3.81,0; 3 1.27,0; 4 -1.27,0; 5 -3.81,0; 6 -6.35,0
L3225P = smd 1.8 x 2: 1 -1.4,0; 2 1.4,0
LCD-20X4 = drill 1 pad 1.676: 1 10.16,57.785; 2 12.7,57.785; 3 15.24,57.785; 4 17.78,57.785; 5 20.32,57.785; 6 22.86,57.785; 7 25.4,57.785; 8 27.94,57.785; 9 30.48,57.785; 10 33.02,57.785; 11 35.56,57.785; 12 38.1,57.785; 13 40.64,57.785; 14 43.18,57.785; 15 45.72,57.785; 16 48.26,57.785 | hole 2.603: 2.54,2.54; 95.885,2.54; 95.885,57.785; 2.54,57.785
CHIPLED_1206 = smd 1.5 x 1.5: A 0,-1.75; C 0,1.75
SMD4 = smd 1.78 x 1.55: 1 -1.27,-3.5; 2 1.27,-3.5; 3 1.27,3.5; 4 -1.27,3.5
6-SMD = smd 1.78 x 1.52: 1 -2.54,-4.645; 2 0,-4.645; 3 2.54,-4.645; 4 2.54,4.645; 5 0,4.645; 6 -2.54,4.645
SOT23 = smd 1 x 1.4: 1 -0.95,-1.1; 2 0.95,-1.1; 3 0,1.1
R1206 = smd 1.6 x 1.803: 1 -1.422,0; 2 1.422,0
M1206 = smd 1.6 x 2: 1 -1.4,0; 2 1.4,0
TRIMMER_3314G = smd 1.3 x 1.3: 1 -1.15,2.75; 3 1.15,2.75 | smd 2 x 1.3: 2 0,-2.75
R2512 = smd 1.8 x 3.2: 1 -2.8,0; 2 2.8,0
F/EE17P = drill 1.194 pad 2.54 octagon: 1 -5.004,0; 2 5.004,0
SJ = smd 1.168 x 1.6: 1 -0.762,0; 2 0.762,0
BOURNS_PEC11R_SW = drill 1 square: A -2.5,-7.5; B 2.5,-7.5; C 0,-7.5; S -2.5,7; W 2.5,7 | drill 2.2 square: GND1 -6.1,0; GND2 6.1,0
SW_TACTILE_TOP_ACTIVATED = drill 1 pad 1.778: 1 -3.264,2.235; 2 3.239,2.235; 3 -3.264,-2.261; 4 3.239,-2.261
DPAK-TRIAC = smd 1 x 1.6: A1 -2.28,-6.07; G 2.28,-6.07 | smd 5.4 x 6.2: A2 0,1.23
SOIC-32 = smd 0.6 x 1.524: 1 -8.89,-5.08; 2 -7.62,-5.08; 3 -6.35,-5.08; 4 -5.08,-5.08; 5 -3.81,-5.08; 6 -2.54,-5.08; 7 -1.27,-5.08; 8 0,-5.08; 9 1.27,-5.08; 10 2.54,-5.08; 11 3.81,-5.08; 12 5.08,-5.08; 13 6.35,-5.08; 14 7.62,-5.08; 15 8.89,-5.08; 16 10.16,-5.08; 17 10.16,4.445; 18 8.89,4.445; 19 7.62,4.445; 20 6.35,4.445; 21 5.08,4.445; 22 3.81,4.445; 23 2.54,4.445; 24 1.27,4.445; 25 0,4.445; 26 -1.27,4.445; 27 -2.54,4.445; 28 -3.81,4.445; 29 -5.08,4.445; 30 -6.35,4.445; 31 -7.62,4.445; 32 -8.89,4.445
SO08 = smd 0.6 x 2.2: 1 -1.905,-2.6; 2 -0.635,-2.6; 3 0.635,-2.6; 4 1.905,-2.6; 5 1.905,2.6; 6 0.635,2.6; 7 -0.635,2.6; 8 -1.905,2.6
FS10-110-C2 = drill 1.524 square: P$1 -9.525,-14.922; P$2 -3.175,-14.922; P$3 3.175,-14.922; P$4 9.525,-14.922; P$5 -9.525,15.557; P$6 -3.175,15.557; P$7 3.175,15.557; P$8 9.525,15.557

### Placement (x,y rotation side)
C1  118.11,58.42 270 top
C2  118.11,83.82 270 top
C3  118.11,46.99 90 top
C4  10.16,74.93 270 top
C5  67.31,50.8 0 top
C6  71.12,80.01 270 top
C7  95.25,148.59 90 top
C8  105.41,148.59 90 top
C9  107.95,114.3 180 top
C10  25.4,97.79 180 top
C11  114.3,125.73 180 top
C12  55.88,107.95 270 top
C13  48.26,107.95 270 top
C14  93.34,30.73 180 top
C15  78.74,19.05 0 top
C16  52.07,48.26 180 top
D1  100.33,114.3 90 top
D2  43.18,41.91 180 top
D3  116.84,140.97 180 top
D4  113.03,140.97 180 top
D5  116.84,135.89 180 top
D6  113.03,135.89 180 top
D7  77.47,25.4 270 top
D8  80.01,25.4 270 top
D9  74.93,22.86 90 top
D10  82.55,22.86 90 top
D11  87.63,22.86 0 top
D16  55.88,41.91 270 top
F1  81.28,8.89 180 top
F2  116.84,15.24 0 top
F3  12.7,19.05 90 top
J1  128.27,66.04 270 top
J2  46.99,143.51 0 top
J3  116.84,6.35 0 top
J4  16.51,69.85 180 top
J5  16.51,57.15 180 top
J6  130.81,132.08 270 top
J7  16.51,124.46 180 top
J8  25.4,12.7 0 top
J9  25.4,5.08 0 top
J10  16.51,85.09 180 top
J11  130.81,22.86 0 top
J12  130.81,30.48 0 top
J13  93.98,8.89 180 top
J14  93.98,16.51 180 top
L1  67.31,80.01 270 top
L2  16.51,158.75 0 top
LCD1  130.81,101.6 0 bottom
LED2  118.75,73.03 270 top
LOGO1  8.89,44.45 0 top
OK1  81.28,35.56 0 top
OK2  102.87,35.56 180 top
OK3  26.67,35.56 180 top
Q1  88.9,27.94 0 top
Q2  8.89,97.79 270 top
Q4  24.13,158.75 90 top
R1  50.8,41.91 0 top
R2  119.38,76.2 0 top
R3  46.99,152.4 0 top
R4  100.33,124.46 90 top
R5  93.98,115.57 270 top
R6  91.44,139.7 0 top
R7  91.44,134.62 0 top
R8  99.06,130.81 180 top
R9  100.33,119.38 90 top
R10  29.21,44.45 270 top
R12  10.16,105.41 0 top
R13  72.39,19.05 0 top
R14  114.3,128.27 0 top
R16  123.19,152.4 0 top
R17  60.96,107.95 90 top
R18  63.5,101.6 180 top
R19  77.47,101.6 180 top
R20  92.71,101.6 180 top
R21  107.95,101.6 180 top
R22  29.21,156.21 90 top
R23  27.94,93.98 90 top
R24  22.86,105.41 0 top
R25  48.26,123.19 90 top
R26  55.88,123.19 90 top
R27  55.88,115.57 270 top
R28  48.26,115.57 270 top
R29  15.24,74.93 90 top
R30  83.82,17.78 90 top
R31  76.2,29.21 0 top
R32  81.28,29.21 180 top
R33  80.01,43.18 90 top
R34  124.46,127 90 top
R35  124.46,135.89 270 top
R36  105.41,26.67 270 top
R37  105.41,44.45 270 top
R38  58.42,43.18 270 top
R39  27.94,27.94 180 top
SG1  16.51,147.32 0 bottom
SJ1  79.69,78.11 0 top
SJ2  71.12,34.29 270 top
SW1  52.07,92.71 90 bottom
SW2  69.85,92.71 0 bottom
SW3  85.09,92.71 0 bottom
SW4  100.33,92.71 0 bottom
SW5  115.57,92.71 0 bottom
T1  114.3,27.94 90 top
T2  25.4,21.59 90 top
U1  66.04,64.77 0 top
U3  100.33,140.97 0 top
X1  50.8,22.1 0 top

### Tracks (layer width: path | path; a pad name or v marks a point on that pad's centre or on a via)
240A
  Top 0.635: J13.A2 F1.1
  Top 3.81: J13.A2 J13.A1 102.87,8.89 104.14,10.16 104.14,14.22 F2.1A F2.1B
240B  (1 unrouted)
  Top 0.254: 96.52,16.62 J14.A1 | R36.2 105.41,24.13
  Top 0.635: J14.A2 83.97,16.51 R30.1 82.4,16.36 80.01,13.97
  Top 3.81: J14.A2 J14.A1 96.63,21.7 99.06,24.13 105.41,24.13 113.03,24.13 113.03,27.9 T1.A2
  Bottom 0.635: X1.P$4 60.33,10.79 63.5,13.97
+5V  (via drill 0.61)
  Top 0.635: SG1.1 19.05,147.32 17.78,148.59 17.78,158.62 L2.2 | 53.98,124.59 R26.2 | 53.98,124.59 R25.2 | v59.05,109.47 60.96,109.47 R17.2 | v53.98,124.33 53.98,124.59 | v65.41,81.53 67.31,81.53 L1.1 | v21.34,107.57 21.34,105.41 R24.1 | J2.2 44.45,145.29 45.47,146.3 45.47,152.4 R3.1 45.59,152.43 45.59,161.42 46.74,162.56 85.09,162.56 | v66.04,61.34 U1.8 66.04,51.03 C5.1 65.81,49.44 70.55,44.7 80.01,44.7 R33.2 80.26,44.83 99.44,44.83 114.05,59.44 C1.+ 125.22,59.44 J1.4 127.05,59.74 128.27,60.96 128.27,68.14 | 128.27,68.14 128.27,77.99 J1.19 J1.20 131.04,84.94 134.37,88.27 134.37,141.22 124.46,151.13 124.46,154.94 R16.3 124.33,155.19 121.79,157.73 119.76,157.73 LCD1.2 118.11,161.29 116.84,162.56 85.09,162.56 | J1.6 128.27,68.14 | LCD1.15 85.09,162.56
  Bottom 0.635: 59.18,109.22 v59.05,109.47 59.05,119.25 v53.98,124.33 53.85,124.59 53.85,130.68 40.01,144.53 40.01,144.78 | J5.6 J4.6 J10.6 22.73,85.34 22.48,106.43 v21.34,107.57 21.34,123.44 J7.5 20.45,124.71 20.45,140.97 24,144.53 24.13,144.78 | 24.13,144.78 40.01,144.78 | 40.01,144.78 J2.2 | 24.13,144.78 21.59,147.32 SG1.1 | v66.04,61.34 64.14,63.25 64.14,80.14 65.28,81.28 v65.41,81.53
+12V  (via drill 0.61)
  Top 0.635: J1.10 125.48,84.84 C2.+ 117.86,84.71 80.39,47.24 v71.37,47.24 | 98.42,143.64 U3.8 98.42,146.69 98.55,146.81 | 90.04,139.7 R6.1 90.17,139.7 90.17,146.05 91.31,147.19 C7.1 95.25,146.81 98.55,146.81 | v100.97,141.48 U3.6 100.97,145.92 100.08,146.81 98.55,146.81 | J5.2 12.7,55.88 v14.48,54.1
  Bottom 0.635: J5.2 J4.2 12.83,70.1 | C2.+ 118.11,88.9 114.3,92.71 114.3,128.14 v100.97,141.48 | v14.48,54.1 22.35,54.1 30.86,45.59 69.72,45.59 v71.37,47.24
-12V  (via drill 0.61)
  Top 0.635: 105.41,146.81 C8.1 103.38,147.19 102.23,146.05 U3.5 U3.4 102.49,138.18 v106.05,138.18 | C3.- 119.51,49.4 129.03,49.4 130.94,51.31 J1.12
  Bottom 0.635: v106.05,138.18 106.05,137.92 120.52,123.44 120.52,50.42 C3.-
AGND
  pour Top: 64.14,64.14 64.14,83.19 79.38,83.19 79.38,62.87 76.83,60.33 74.3,60.33 74.3,64.14
AVCC  (via drill 0.61)
  Top 0.635: U1.25 66.04,70.1 66.67,70.74 | 66.67,70.74 67.94,70.74 68.71,69.98 68.71,69.85 68.58,69.72 U1.23 | 69.22,78.61 L1.2 | 69.22,78.61 71.12,78.61 C6.2 | v66.67,70.87 66.67,70.74 | v69.22,78.36 69.22,78.61
  Bottom 0.635: v66.67,70.87 66.67,75.82 v69.22,78.36
FAULT
  Top 0.254: J4.3 R29.1
  Bottom 0.254: J4.3 J5.3
GND  (via drill 0.61)
  other vias: 109.22,149.86 128.27,142.24 78.74,90.17 86.36,86.36 86.36,76.2 86.36,68.58 86.36,60.96 71.12,86.36 76.2,86.36 58.2,85.74 80.52,74.3 57.53,48.26 55.24,64.14 39.37,74.93 26.67,53.34 26.67,63.5 20.32,63.5 16.51,63.5 20.32,80.01 30.48,82.55 40.64,91.44 34.29,85.09 44.45,85.09 52.07,81.28 67.31,110.49 57.15,129.54 19.05,143.51 17.78,119.38 59.37,80.96 127,36.83 91.44,41.91 66.04,41.91 12.7,39.37 48.26,160.02 59.56,66.67 57.78,64.14 63.5,47.24 67.44,57.02 69.22,52.7 64.77,52.7 76.2,53.34 19.05,73.66 21.59,59.69 18.41,63.5 6.35,134.62 60.36,85.74 10.16,63.5 6.35,63.5 60.58,90.17
  pour Top: 0,165.1 0,35.56 63.5,35.56 63.5,165.1
  pour Bottom: 0,165.1 0,35.56 139.7,35.56 139.7,165.1
  pour Top: 63.5,35.56 139.7,35.56 139.7,165.1 63.5,165.1 63.5,83.82 80.01,83.82 80.01,62.23 77.47,59.69 73.66,59.69 73.66,63.5 63.5,63.5
  pour Top: 0,35.56 7.62,35.56 7.62,165.1 0,165.1
  pour Top: 54.61,161.29 54.61,156.21 81.28,156.21 81.28,161.29
MGND  (via drill 0.61)
  Top 0.635: SJ2.2 v71.12,30.48
  other vias: 94.87,3.43 44.83,3.43
  pour Bottom (isolate 1.27): 0,0 0,33.02 139.7,33.02 139.7,0
  pour Top: 44.45,0 44.45,3.81 95.25,3.81 95.25,0
N$1
  Top 0.254: OK3.1 R10.2
N$2
  Top 0.254: R39.1 29.34,30.35 29.21,30.48 OK3.6
N$3
  Top 0.635: R16.2 123.19,151.64 115.57,159.26 LCD1.3
N$4
  Top 0.254: R37.2 OK2.1
N$5
  Top 0.254: LED2.A 117.09,73.03 117.09,75.44 117.86,76.2 R2.1
N$6
  Top 0.254: R9.2 R4.1 100.33,123.06 102.36,123.06 103,123.7 103,126.11 109.6,132.72 109.6,141.48 111.89,143.76 119.51,143.76 124.46,138.81 R35.1 124.71,138.43 J6.6
N$7
  Top 0.254: R39.2 25.4,27.94 24.13,26.67 24.13,21.63 T2.A2
  Top 3.81: F3.2B F3.2A 17.53,23.11 19.05,21.59 T2.A2
N$9
  Top 0.254: R4.2 100.33,130.68 100.46,130.81 R8.1 100.58,130.81 100.97,131.19 U3.3
N$10  (via drill 0.61)
  Top 0.254: Q2.3 v13.72,97.79
  Bottom 0.254: v13.72,97.79 13.72,123.44 J7.2
N$11
  Top 0.254: OK3.4 24.13,31.75 25.4,33.02 30.48,33.02 31.75,31.75 31.75,24.15 T2.G
N$12
  Top 0.254: R8.2 96.77,130.81 92.96,134.62 R7.2 92.84,134.62 92.84,138.43 | 92.84,138.43 92.84,139.7 R6.2 | 92.84,138.43 98.42,138.43 U3.1
N$13
  Top 0.254: R9.1 D1.A
N$14
  Top 0.254: Q2.1 7.87,98.81 7.87,100.08 11.56,103.76 11.56,105.41 R12.2
N$15
  Top 0.254: D4.C D3.A 116.33,140.97 117.35,141.99 118.49,141.99 120.52,139.95 120.52,132.46 124.46,128.52 R34.2 124.46,128.4 124.59,128.27 J6.2
N$16
  Top 0.635: D6.C D5.A 115.82,135.64 115.82,134.24 121.92,128.14 121.92,126.24 122.56,125.6 124.46,125.6 R34.1 124.71,125.73 J6.1
N$17  (via drill 0.61)
  Top 0.635: R23.2 27.94,97.79 | 27.94,97.79 C10.1 | 24.38,103 24.38,102.87 27.94,99.31 27.94,97.79 | 24.38,103 24.38,105.41 R24.2 | v24.13,102.87 24.51,102.87 24.38,103
  Bottom 0.635: J7.6 22.86,111 24.13,109.73 v24.13,102.87
N$18  (1 unrouted)
N$19
  Top 0.635: SG1.2 11.43,147.32 11.43,157.48 12.7,158.75 L2.1 15.24,158.88 15.24,160.02 16.51,161.29 21.59,161.29 23.03,159.85 Q4.3
N$20
  Top 0.635: Q4.1 29.02,157.8 R22.2
N$21  (via drill 0.61)
  Top 0.635: R25.1 48.26,118.75 | 48.26,118.75 R28.1 | v48.01,118.75 48.26,118.75
  Bottom 0.635: v48.01,118.75 44.58,115.32 44.58,95.25 SW1.B
N$22  (via drill 0.61)
  Top 0.635: R26.1 55.88,118.75 | 55.88,118.75 R27.1 | v55.63,118.75 55.88,118.75
  Bottom 0.635: v55.63,118.75 49.4,112.52 49.4,95 45.59,91.19 45.47,91.19 44.58,90.3 SW1.A
N$23
  Top 0.635: R21.1 109.47,101.6 109.47,97.79 112.27,95 SW5.2 112.65,94.87 118.75,94.87 SW5.1
N$24
  Top 0.635: R18.1 65.02,101.6 65.02,96.52 66.55,95 SW2.2 66.93,94.87 72.9,94.87 SW2.1 73.15,95 75.95,97.79 75.95,101.6 R19.2
N$25
  Top 0.635: R20.2 91.19,101.6 91.19,97.79 88.39,95 SW3.1 88.14,94.87 82.17,94.87 SW3.2 81.79,95 78.99,97.79 78.99,101.6 R19.1
N$26
  Top 0.635: R21.2 106.43,101.6 106.43,97.79 103.63,95 SW4.1 103.38,94.87 97.41,94.87 SW4.2 97.03,95 94.23,97.79 94.23,101.6 R20.1
N$28
  Top 0.635: X1.P$2 X1.P$3
N$29
  Top 0.254: R13.2 73.81,21.11 D9.C D7.A 77.34,22.1 C15.1
N$30
  Top 0.254: C15.2 80.01,19.18 D8.A D10.C 82.55,21.59 83.82,20.32 R30.2
N$31
  Top 0.406: R36.1 OK2.6
N$32
  Top 0.406: OK2.4 100.33,31.75 101.6,33.02 119.38,33.02 120.65,31.75 120.65,30.5 T1.G
N$33  (via drill 0.61)
  Top 0.254: R31.1 74.78,26.18 D9.A 74.3,25.4 v72.39,25.4 | D11.C 87.63,23.49 87.63,24.13 87.95,24.45 Q1.1 83.36,26.84 D10.A 83.18,25.4 v85.09,25.4
  Bottom 0.254: v85.09,25.4 v72.39,25.4
N$34  (via drill 0.61)
  Top 0.254: R31.2 77.62,26.18 D7.C D8.C 80.01,26.52 R32.1 v86.36,29.21 | v89.41,30.73 C14.+
  Bottom 0.254: v86.36,29.21 86.36,30.23 86.87,30.73 v89.41,30.73
N$35
  Top 0.254: D11.A 90.17,23.49 90.17,24.13 89.85,24.45 Q1.2 91.25,26.84 C14.-
N$37
  Top 3.81: T1.A1 122.18,25.66 127,30.48 J12.A1 J12.A2
N$38
  Top 0.254: R32.2 79.86,31.91 OK1.1
N$39
  Top 0.254: OK1.2 86.05,32.06 88.9,29.21 Q1.3
N$40
  Top 3.81: F2.2A F2.2B 128.52,22.5 J11.A1 J11.A2
N$43
  Top 3.81: J8.A1 J8.A2 30.48,12.7 31.47,13.69 T2.A1
N$44  (1 unrouted)
  Top 0.254: 46.19,45.08 C16.+ R1.1
N$45  (1 unrouted)
  Top 0.635: X1.P$1 41.27,15.88 44.45,19.05 67.31,19.05 | 67.31,19.05 R13.1 | 68.58,8.89 67.31,10.16 67.31,19.05
N$46
  Top 3.81: J9.A2 J9.A1 14.99,5.08 F3.1A F3.1B
PB0  (via drill 0.61)
  Top 0.254: U1.12 71.12,56.52 v69.98,55.37 | v64.77,56.64 v64.77,54.61 | v24.13,54.1 23.75,54.48 21.97,54.48 20.32,56.13 J5.5
  Bottom 0.254: J5.5 20.32,60.71 21.59,61.98 21.59,71.25 20.95,71.88 19.68,71.88 17.78,69.98 J4.4 | v69.98,55.37 69.22,54.61 v64.77,54.61 | v64.77,56.64 26.67,56.64 v24.13,54.1
PB1  (via drill 0.61)
  Top 0.254: U1.13 72.39,56.26 v70.1,53.98 | v64.14,49.78 64.14,48.13 64.52,47.75 v64.52,44.32 | v20.95,52.83 17.78,56.01 J5.4
  Bottom 0.254: J5.4 17.78,60.96 19.3,62.48 19.3,68.71 20.32,69.72 J4.5 | v70.1,53.98 68.33,53.98 v64.14,49.78 | v64.52,44.32 29.46,44.32 v20.95,52.83
PB2  (via drill 0.61)
  Top 0.254: v72.39,67.44 U1.20 | 80.01,41.66 v78.23,43.43 | 80.01,41.66 OK1.4 | 80.01,41.66 R33.1
  Bottom 0.254: v72.39,67.44 72.39,49.28 v78.23,43.43
PB3  (via drill 0.61)
  Top 0.254: U1.27 63.5,67.69 63.88,67.31 v65.41,67.31 | v73.91,76.33 v72.26,74.68
  Bottom 0.254: v65.41,67.31 65.41,67.82 v72.26,74.68 | v73.91,76.33 85.09,87.5 85.09,99.31 91.69,105.92 91.69,155.83 LCD1.11
PB4  (via drill 0.61)
  Top 0.254: U1.28 62.23,70.99 60.58,72.64 60.58,73.66 63.37,76.45 72.52,76.45 v73.79,77.72
  Bottom 0.254: v73.79,77.72 73.79,89.03 91.06,106.3 91.06,157.73 LCD1.12
PB5
  Top 0.254: U1.30 59.69,68.58 58.42,67.31 55.37,67.31 49.4,73.28 49.4,91.44 58.04,100.08 58.04,110.11 70.36,122.43 70.36,139.57 LCD1.13
PB6  (via drill 0.61)
  Top 0.254: U1.31 58.42,70.36 57.91,70.87 57.91,83.63 59.37,85.09 59.37,87.63 62.87,91.06 62.87,92.96 v64.77,94.87
  Bottom 0.254: v64.77,94.87 64.77,136.53 LCD1.14
PB7
  Top 0.254: LCD1.6 105.28,156.72 88.39,156.72 70.99,139.32 70.99,122.05 63.5,114.55 63.5,97.41 57.02,90.93 57.02,69.22 U1.32
PC0  (via drill 0.61)
  Top 0.254: v58.42,61.47 U1.2 | v50.67,107.31 48.64,109.35 48.26,109.35 C13.1 R28.2
  Bottom 0.254: v58.42,61.47 59.69,61.47 62.61,64.39 62.61,81.41 63.75,82.55 63.75,86.74 61.59,88.9 58.04,88.9 57.53,89.41 57.53,93.47 54.23,96.77 54.23,103.76 v50.67,107.31
PC1  (via drill 0.61)
  Top 0.254: U1.7 64.77,61.59 65.66,62.48 v75.18,62.48 | v81.92,65.28 81.92,68.33 92.71,79.12 92.71,111 90.04,113.67 90.04,134.62 R7.1
  Bottom 0.254: v75.18,62.48 79.12,62.48 v81.92,65.28
PC2  (via drill 0.61)
  Top 0.254: v30.73,47.5 29.21,45.97 R10.1 | U1.10 v68.58,55.63
  Bottom 0.254: v68.58,55.63 38.86,55.63 v30.73,47.5
PC3  (via drill 0.61)
  Top 0.254: v69.85,58.04 U1.11 | v21.59,76.2 v24.13,73.66 | v8.76,89.79 12.7,85.85 J10.2 | R12.1 8.76,105.41 v8.76,102.87
  Bottom 0.254: v69.85,58.04 63.75,58.04 62.1,59.69 38.1,59.69 v24.13,73.66 | v21.59,76.2 14.73,83.06 14.61,83.06 12.7,84.96 J10.2 | v8.76,89.79 v8.76,102.87
PC4  (via drill 0.61)
  Top 0.254: 117.98,136.91 117.98,140.97 D3.C | 117.98,136.91 117.98,135.89 D5.C | U1.21 71.12,67.69 v70.99,67.56 | C11.1 v111.76,121.79 | C11.1 115.7,128.27 | C11.1 | 117.98,136.91 113.54,136.91 113.16,136.53 113.16,130.81 115.7,128.27 | 115.7,128.27 R14.2
  Bottom 0.254: v70.99,67.56 93.34,90.04 93.34,103.5 v111.76,121.79
PC5  (via drill 0.61)
  Top 0.254: 100.33,113.28 105.03,113.28 106.05,114.3 C9.+ | U1.22 69.85,70.74 v69.98,70.87 | v92.71,112.52 92.71,112.78 93.28,113.35 | 93.28,113.35 93.98,114.05 R5.2 | 100.33,113.28 93.34,113.28 93.28,113.35 | 100.33,113.28 D1.C
  Bottom 0.254: v69.98,70.87 73.28,70.87 92.71,90.3 v92.71,112.52
PC6  (via drill 0.61)
  Top 0.254: 61.98,101.6 61.98,105.41 60.96,106.43 R17.1 | U1.26 64.77,69.98 v61.59,73.15 | v56.52,92.46 59.18,95.12 SW1.W 59.31,95.12 61.98,97.79 61.98,101.6 | 61.98,101.6 R18.2
  Bottom 0.254: v61.59,73.15 61.59,81.41 63.12,82.93 63.12,86.36 61.21,88.27 57.66,88.27 56.52,89.41 v56.52,92.46
PC7  (via drill 0.61)
  Top 0.254: U1.29 60.96,71.25 59.94,72.26 59.94,74.04 v65.41,79.5 | v89.53,150.37 94.11,154.94 108.58,154.94 LCD1.4
  Bottom 0.254: v65.41,79.5 65.41,80.01 67.94,82.55 67.94,87.76 89.53,109.35 v89.53,150.37
PD0  (via drill 0.61)
  Top 0.254: v55.5,58.04 U1.1 | v27.3,154.31 28.32,155.32 28.7,155.32 29.21,154.81 R22.1
  Bottom 0.254: v55.5,58.04 26.42,58.04 23.5,55.12 17.14,55.12 16.51,55.75 16.51,60.71 17.53,61.72 17.53,67.44 16.51,68.45 16.51,78.61 11.43,83.69 11.43,88.01 18.29,94.87 18.29,116.08 16.51,117.86 16.51,146.18 24.64,154.31 v27.3,154.31
PD1  (via drill 0.61)
  Top 0.254: U1.4 60.96,61.21 v61.09,61.34 | v57.4,111 55.88,109.47 C12.1 R27.2
  Bottom 0.254: v61.09,61.34 61.09,61.85 63.25,64.01 63.25,81.03 64.39,82.17 64.39,87.63 57.4,94.61 v57.4,111
PD2  (via drill 0.61)
  Top 0.254: v62.23,58.04 U1.5 | 15.24,76.33 19.56,76.33 v24.13,71.75 24,72.01 v40.13,88.14 | 15.24,76.33 C4.1 | 15.24,76.33 R29.2 | v42.42,140.21 J2.1
  Bottom 0.254: v62.23,58.04 57.02,58.04 56.01,59.05 36.83,59.05 v24.13,71.75 | v42.42,140.21 42.42,90.42 v40.13,88.14
PD3  (via drill 0.61)
  Top 0.254: U1.6 63.5,61.21 58.04,66.67 54.99,66.67 47.62,74.04 v47.62,84.84 | v45.72,140.59 v43.94,138.81
  Bottom 0.254: v47.62,84.84 43.05,89.41 43.05,137.92 v43.94,138.81 | v45.72,140.59 45.72,143.51 J2.4
PD4  (via drill 0.61)
  Top 0.254: U1.16 76.96,59.69 80.9,63.63 80.9,68.33 82.68,70.1 82.68,82.93 73.03,92.58 v65.53,92.58
  Bottom 0.254: v65.53,92.58 62.1,96.01 62.1,131.57 50.16,143.51 48.26,143.51 J2.3
PD5  (via drill 0.61)
  Top 0.254: 55.73,43.18 53.34,43.18 52.22,42.06 R1.2 53.85,41.91 v53.98,42.04 | 55.88,43.18 57.15,44.45 58.27,44.45 | R38.1 v58.42,46.99 | v77.34,66.17 77.34,68.71 76.83,69.22 U1.17 | v71.25,48.77 v74.55,48.77 | J10.4 17.78,84.07 12.06,78.36 v10.41,78.36
  Top 0.406: 55.73,43.18 D16.C 55.88,43.18 | 58.27,44.45 R38.1
  Bottom 0.254: v77.34,66.17 73.41,62.23 73.41,50.67 74.55,49.53 v74.55,48.77 | v71.25,48.77 60.2,48.77 v58.42,46.99 | v10.41,78.36 10.41,74.8 13.97,71.25 13.97,55.24 13.34,54.61 13.34,53.59 24.89,42.04 v53.98,42.04
PD6  (via drill 0.61)
  Top 0.254: U1.18 74.93,70.74 v73.28,72.39 | v68.96,83.31 68.45,83.82 v61.47,83.82 | R23.1 v27.94,89.92
  Bottom 0.254: v73.28,72.39 73.28,75.44 70.23,78.49 70.23,82.04 v68.96,83.31 | v61.47,83.82 42.8,83.82 37.34,89.28 28.57,89.28 v27.94,89.92
PD7  (via drill 0.61)
  Top 0.254: U1.19 73.66,67.69 v73.79,67.56 | v103.89,47.5 105.41,45.97 R37.1 | J10.3 15.24,86.11 16.89,87.76 v24,87.76 | v58.93,82.8 60.96,84.84 68.99,84.85 70.02,83.82 79.76,83.82 81.66,81.92 v81.66,70.61
  Bottom 0.254: v73.79,67.56 74.8,67.56 76.96,69.72 81.66,69.72 | v103.89,47.5 81.66,69.72 | v24,87.76 37.85,87.76 42.42,83.19 58.55,83.19 v58.93,82.8 | 81.66,69.72 v81.66,70.61
PE1  (via drill 0.61)
  Top 0.254: v71.37,50.42 73.28,50.42 73.66,50.8 U1.14 | v71.37,63.5 62.87,63.5 v60.96,65.41 | v19.43,95.89 v28.57,86.74
  Bottom 0.254: v71.37,63.5 v71.37,50.42 | v60.96,65.41 60.96,70.23 48.64,82.55 32.77,82.55 v28.57,86.74 | v19.43,95.89 19.43,122.68 17.78,124.33 J7.4
PE2  (via drill 0.61)
  Top 0.254: U1.15 74.93,60.45 73.91,61.47 v67.69,61.47 | v24.13,80.26 20.32,84.07 J10.5
  Bottom 0.254: v67.69,61.47 66.55,60.33 58.04,60.33 56.64,61.72 56.64,69.09 45.47,80.26 v24.13,80.26
PG
  Top 0.254: R2.2 125.22,76.2 125.48,76.45 J1.8
PS_ON
  Bottom 0.254: J7.1 10.16,89.28 7.75,86.87 7.75,56.9 24.89,39.75 123.32,39.75 128.52,44.96 132.72,44.96 133.35,45.59 133.35,59.18 132.84,59.69 131.07,59.69 J1.14
RESET  (via drill 0.61)
  Top 0.254: v59.69,62.99 U1.3 | v60.71,87.25 64.14,90.68 v64.14,92.46 | J2.5 51.31,144.02 51.31,145.54 48.51,148.34 48.51,152.4 R3.2
  Bottom 0.254: v59.69,62.99 59.69,62.48 61.98,64.77 61.98,71.25 60.58,72.64 60.58,81.41 62.48,83.31 62.48,85.47 v60.71,87.25 | v64.14,92.46 64.14,92.96 61.47,95.63 61.47,130.3 J2.5

### Text on the board
tPlace: RF-CORE-1.1 | ReactorForge.com | Reactor Core REV1.1 | LV | HV | Contactor Coil | 230VAC | Mains GND | Pump Switch | *DANGER HIGH VOLTAGE*
tRestrict: RF-CORE-1.1 | ReactorForge.com | Reactor Core REV1.1 | *DANGER HIGH VOLTAGE*